# Altium schematic sheet PAGE14.SchDoc
size 386 x 246 mm
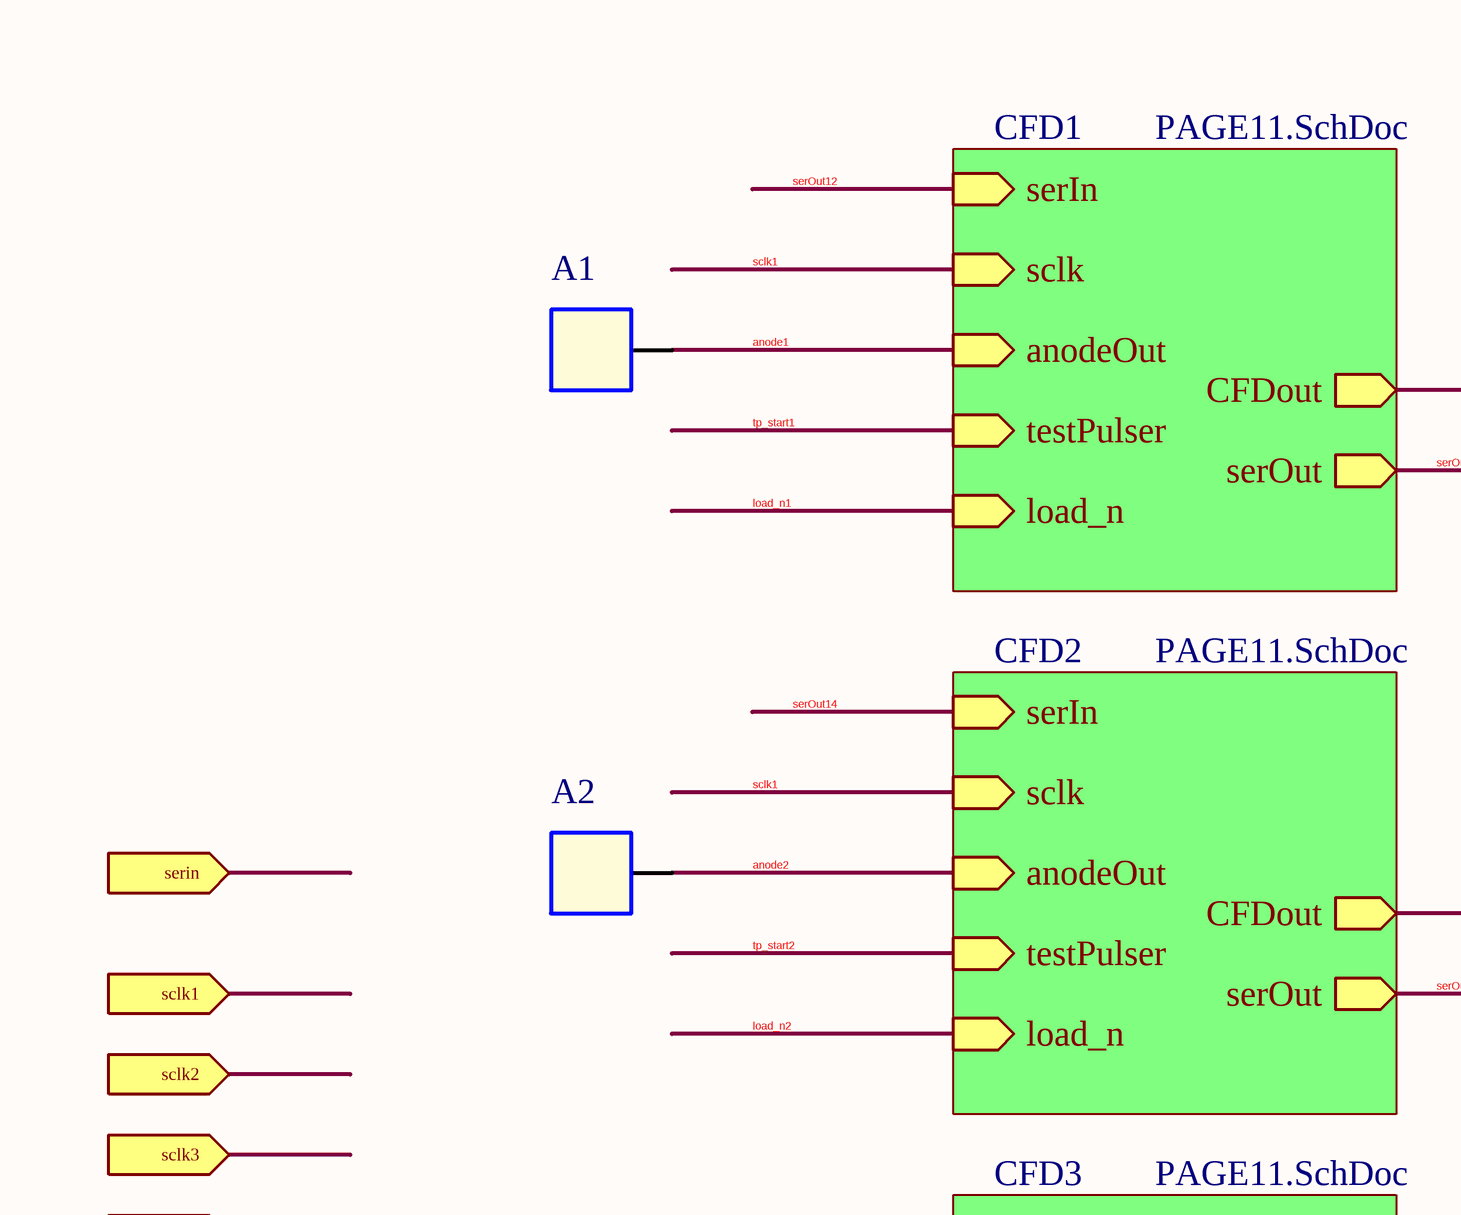
[diagram p0: PAGE14.SchDoc, top column 1 of 4]
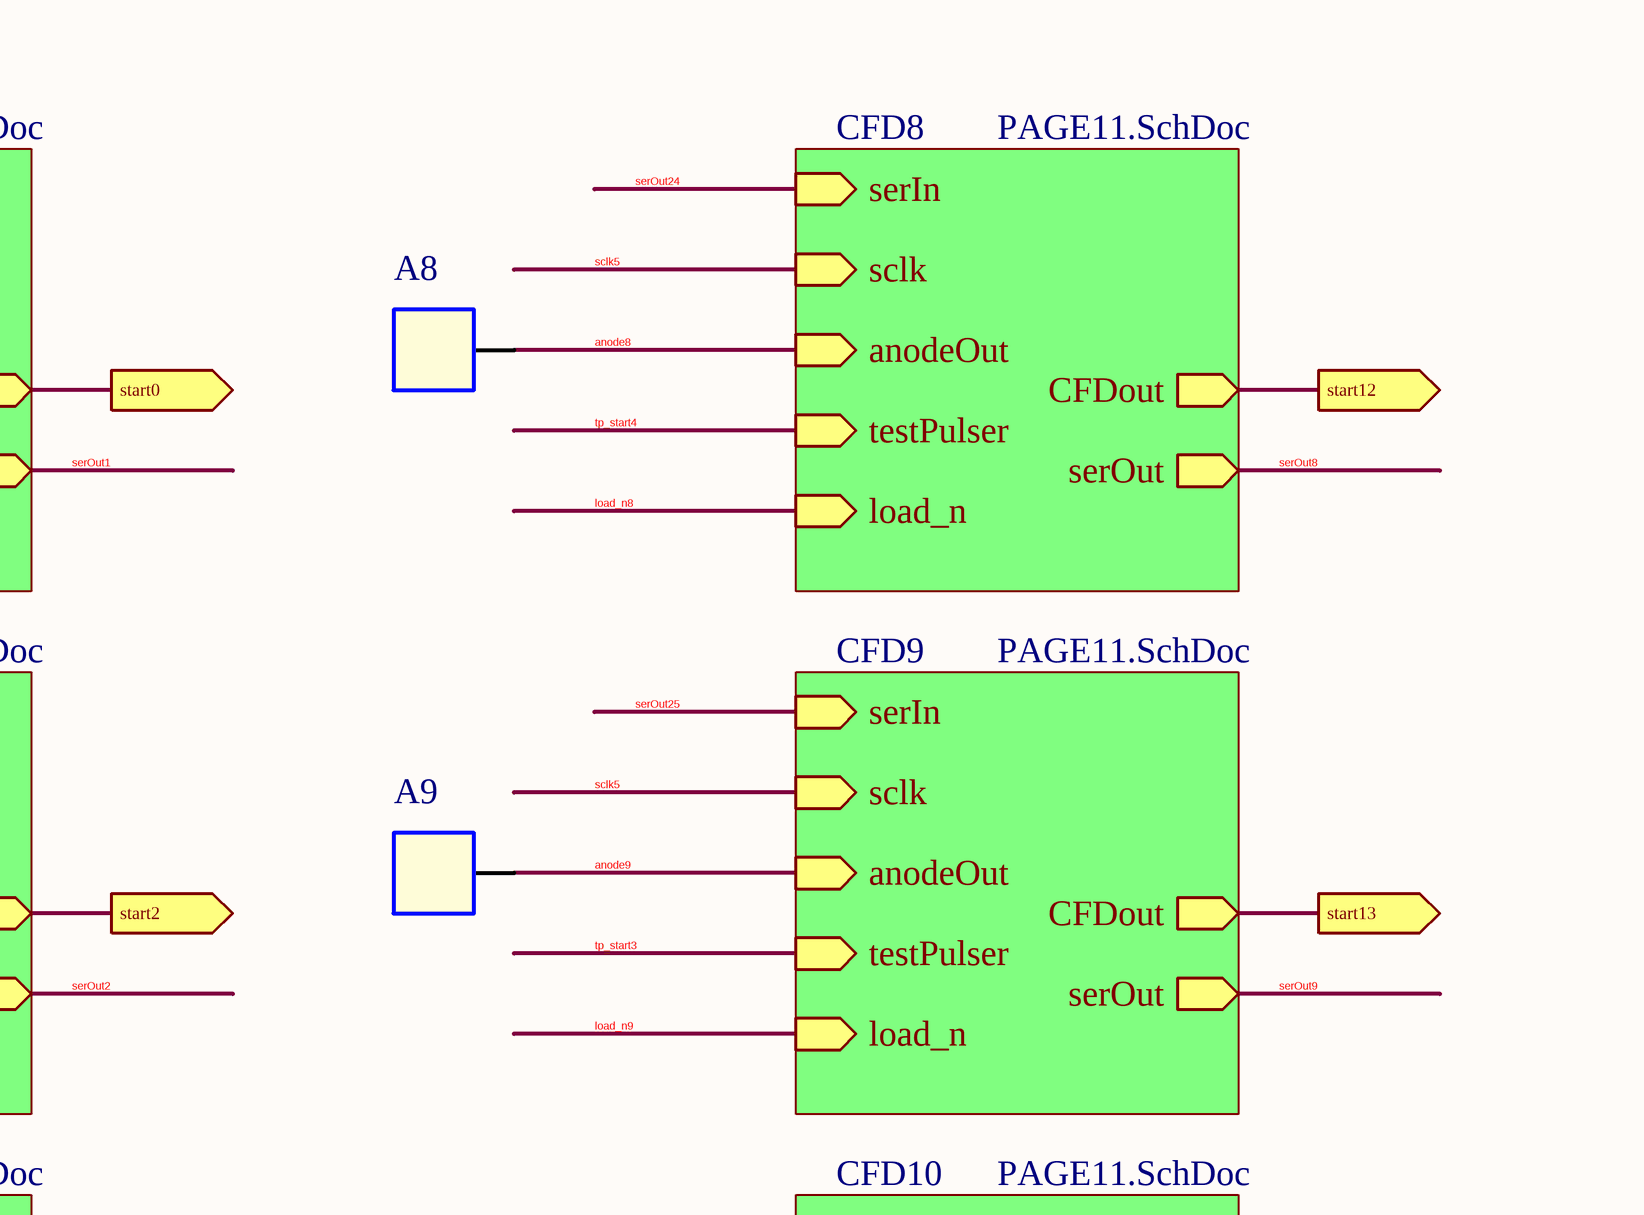
[diagram p1: PAGE14.SchDoc, top column 2 of 4]
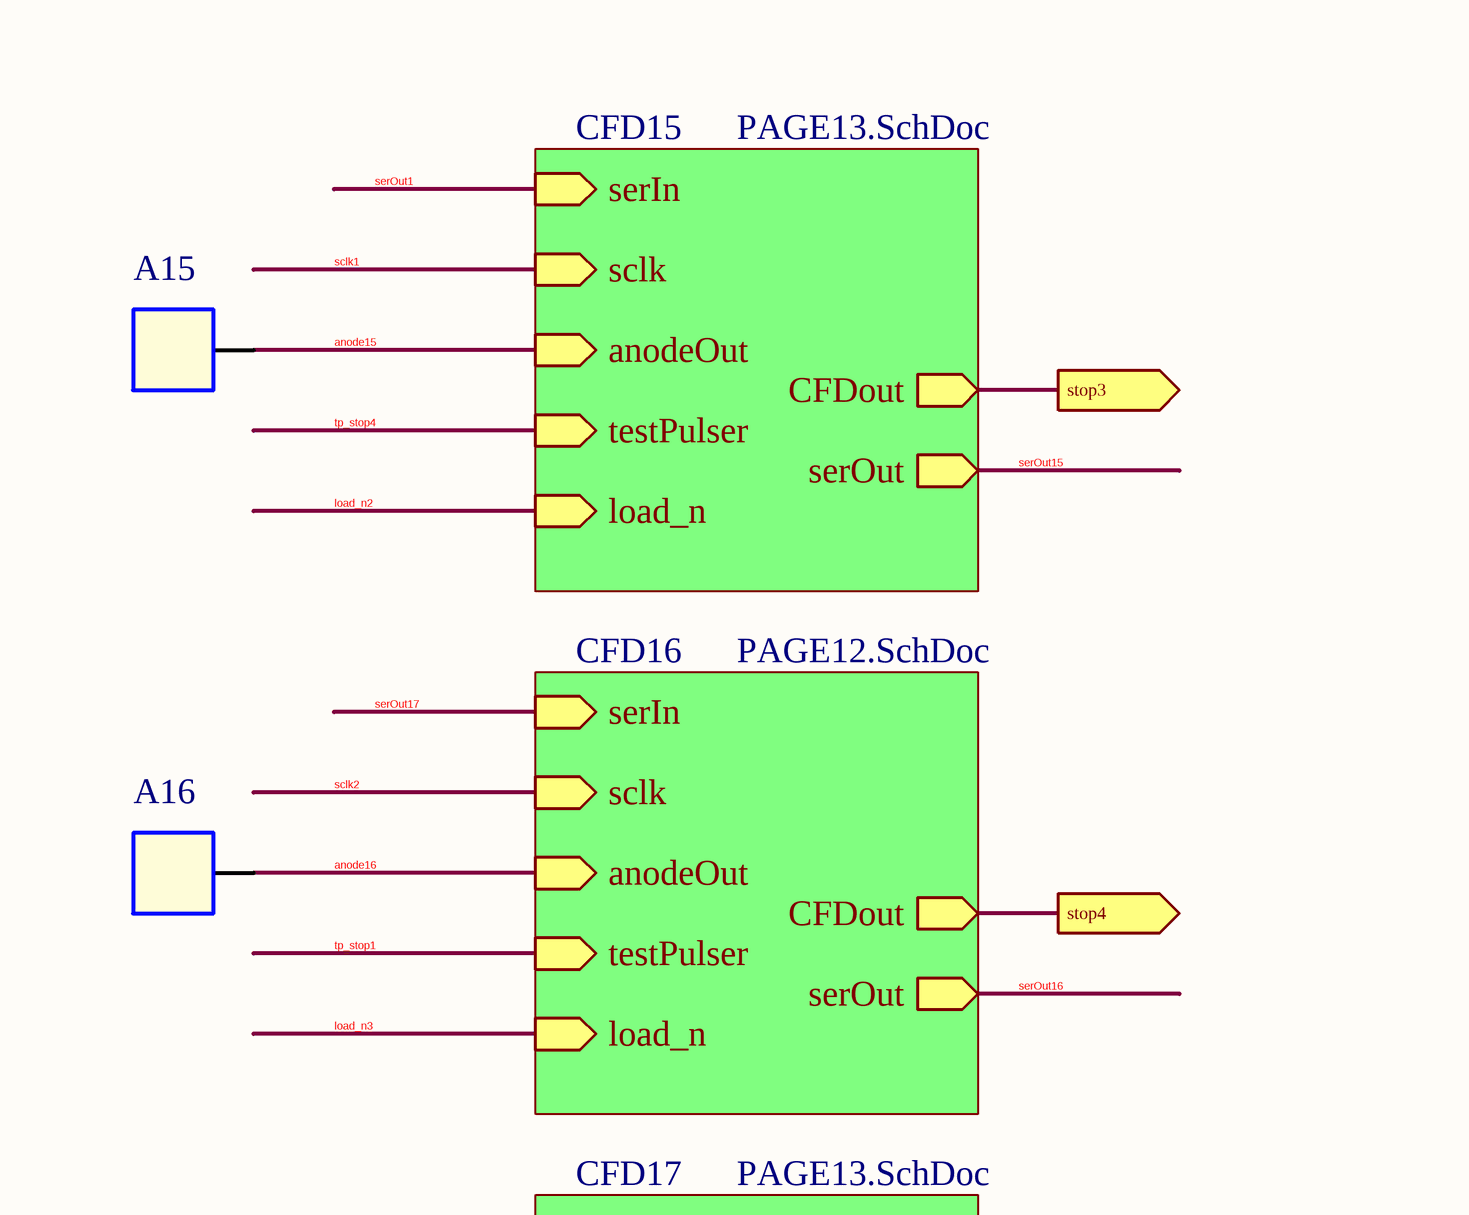
[diagram p2: PAGE14.SchDoc, top column 3 of 4]
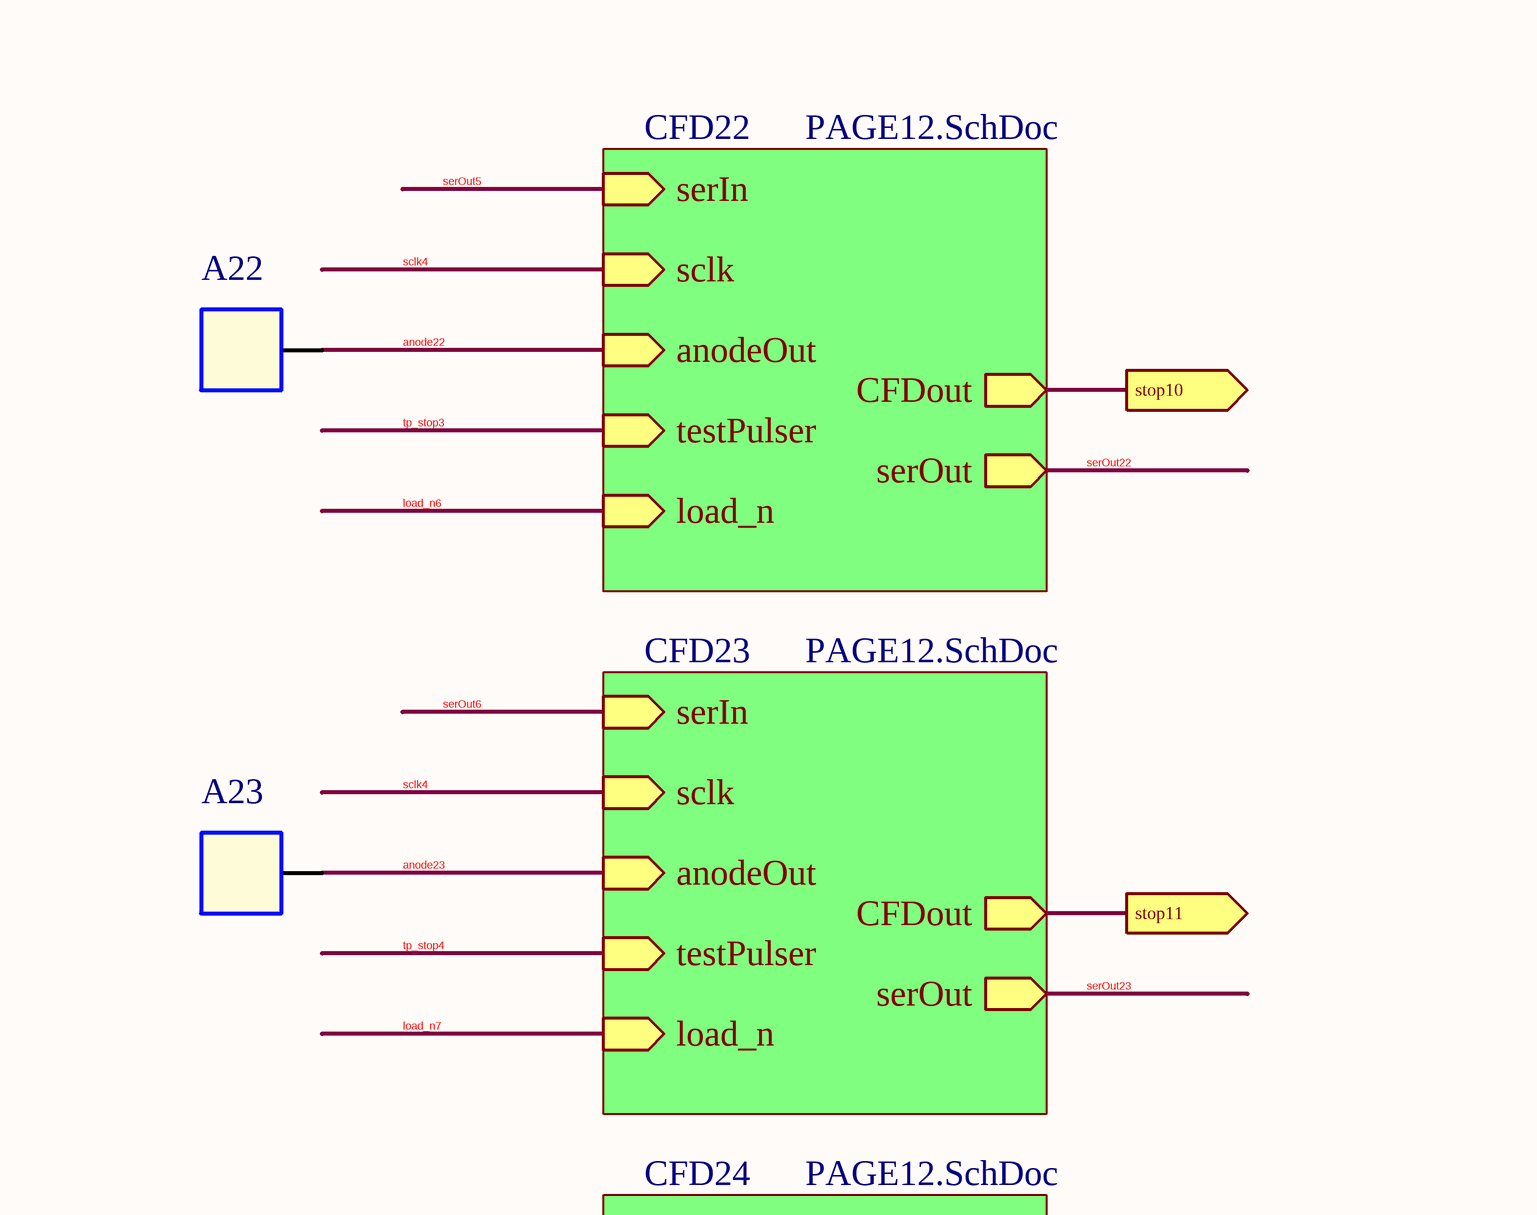
[diagram p3: PAGE14.SchDoc, top column 4 of 4]
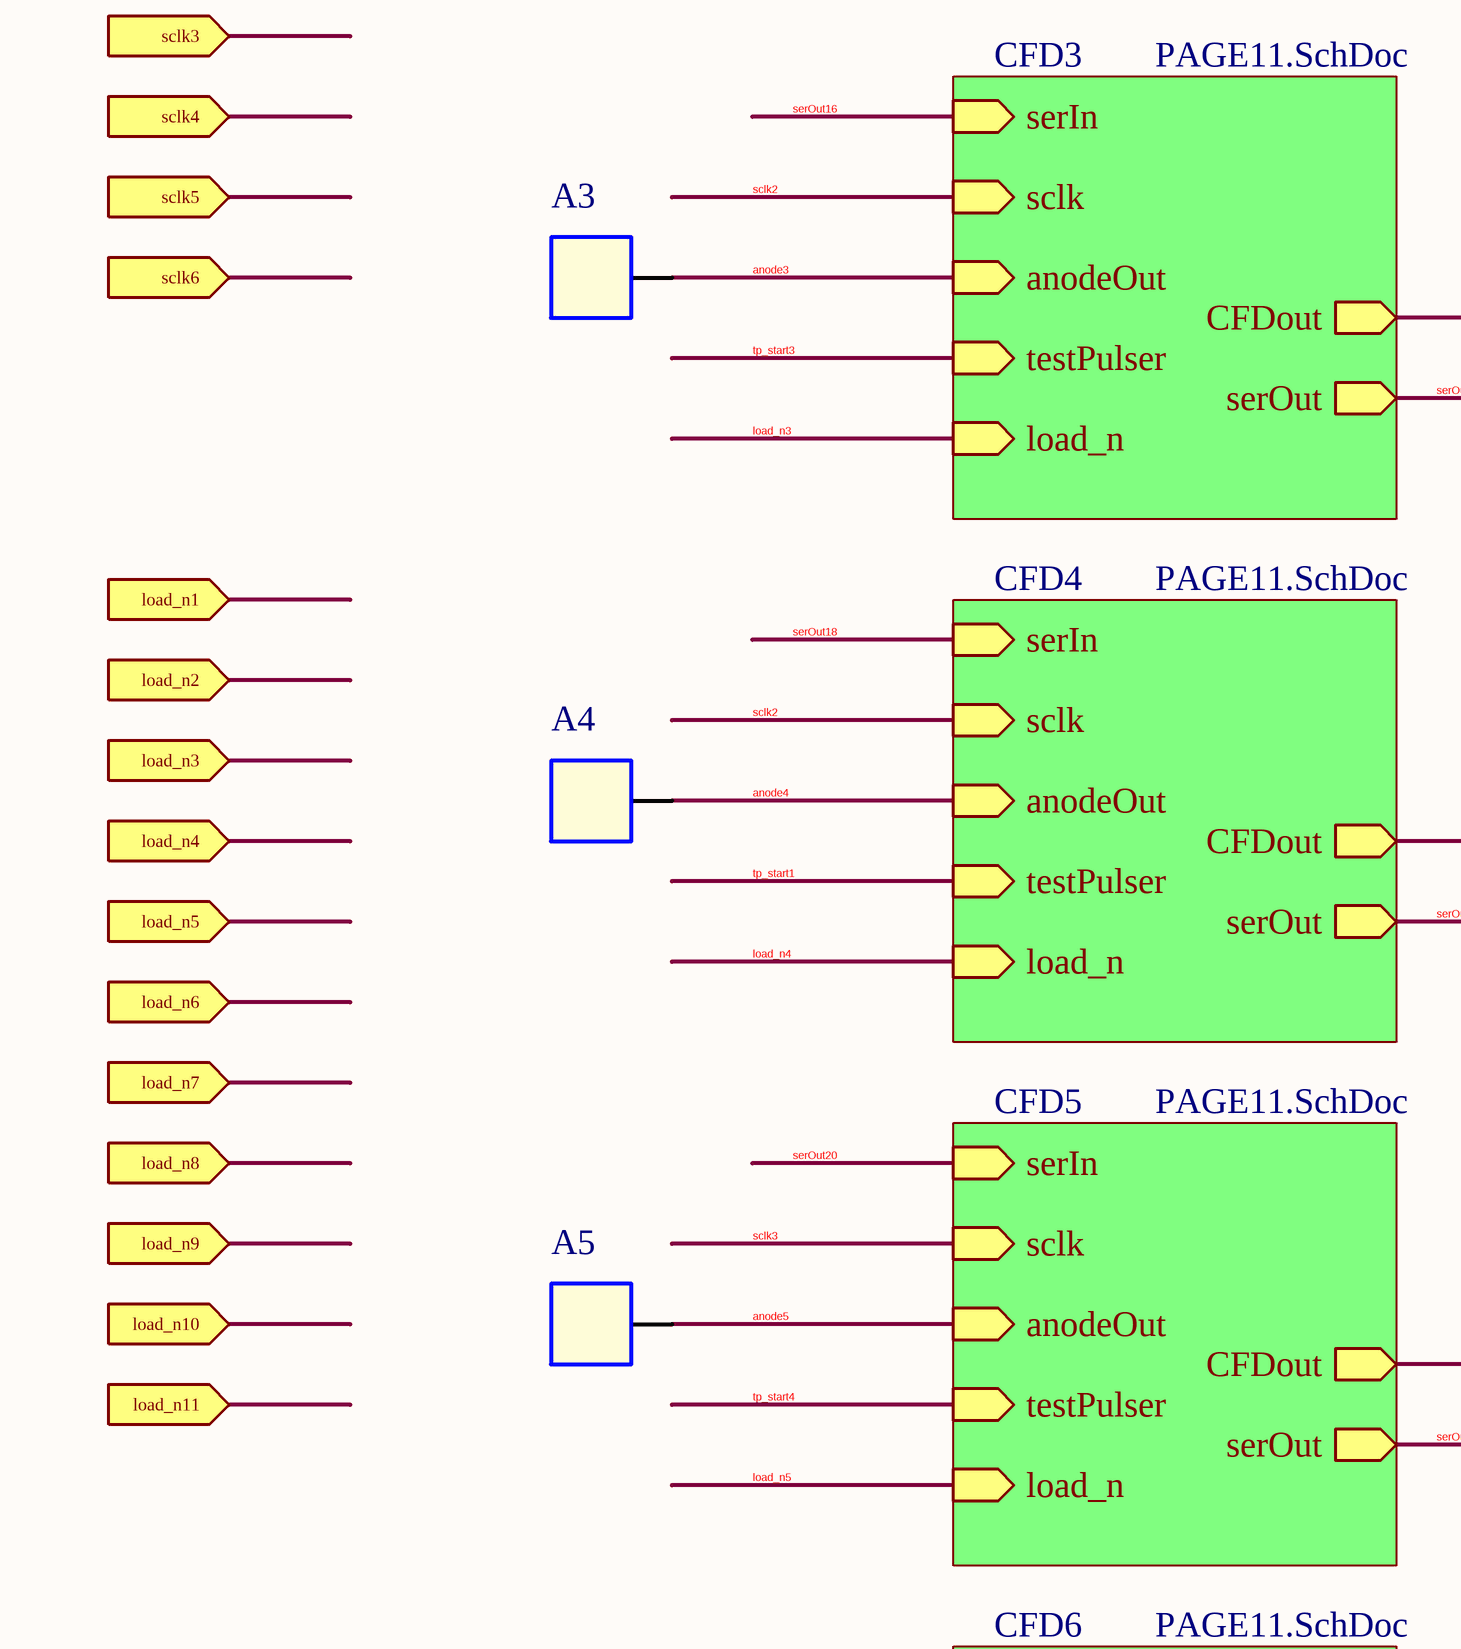
[diagram p4: PAGE14.SchDoc, centre column 1 of 4]
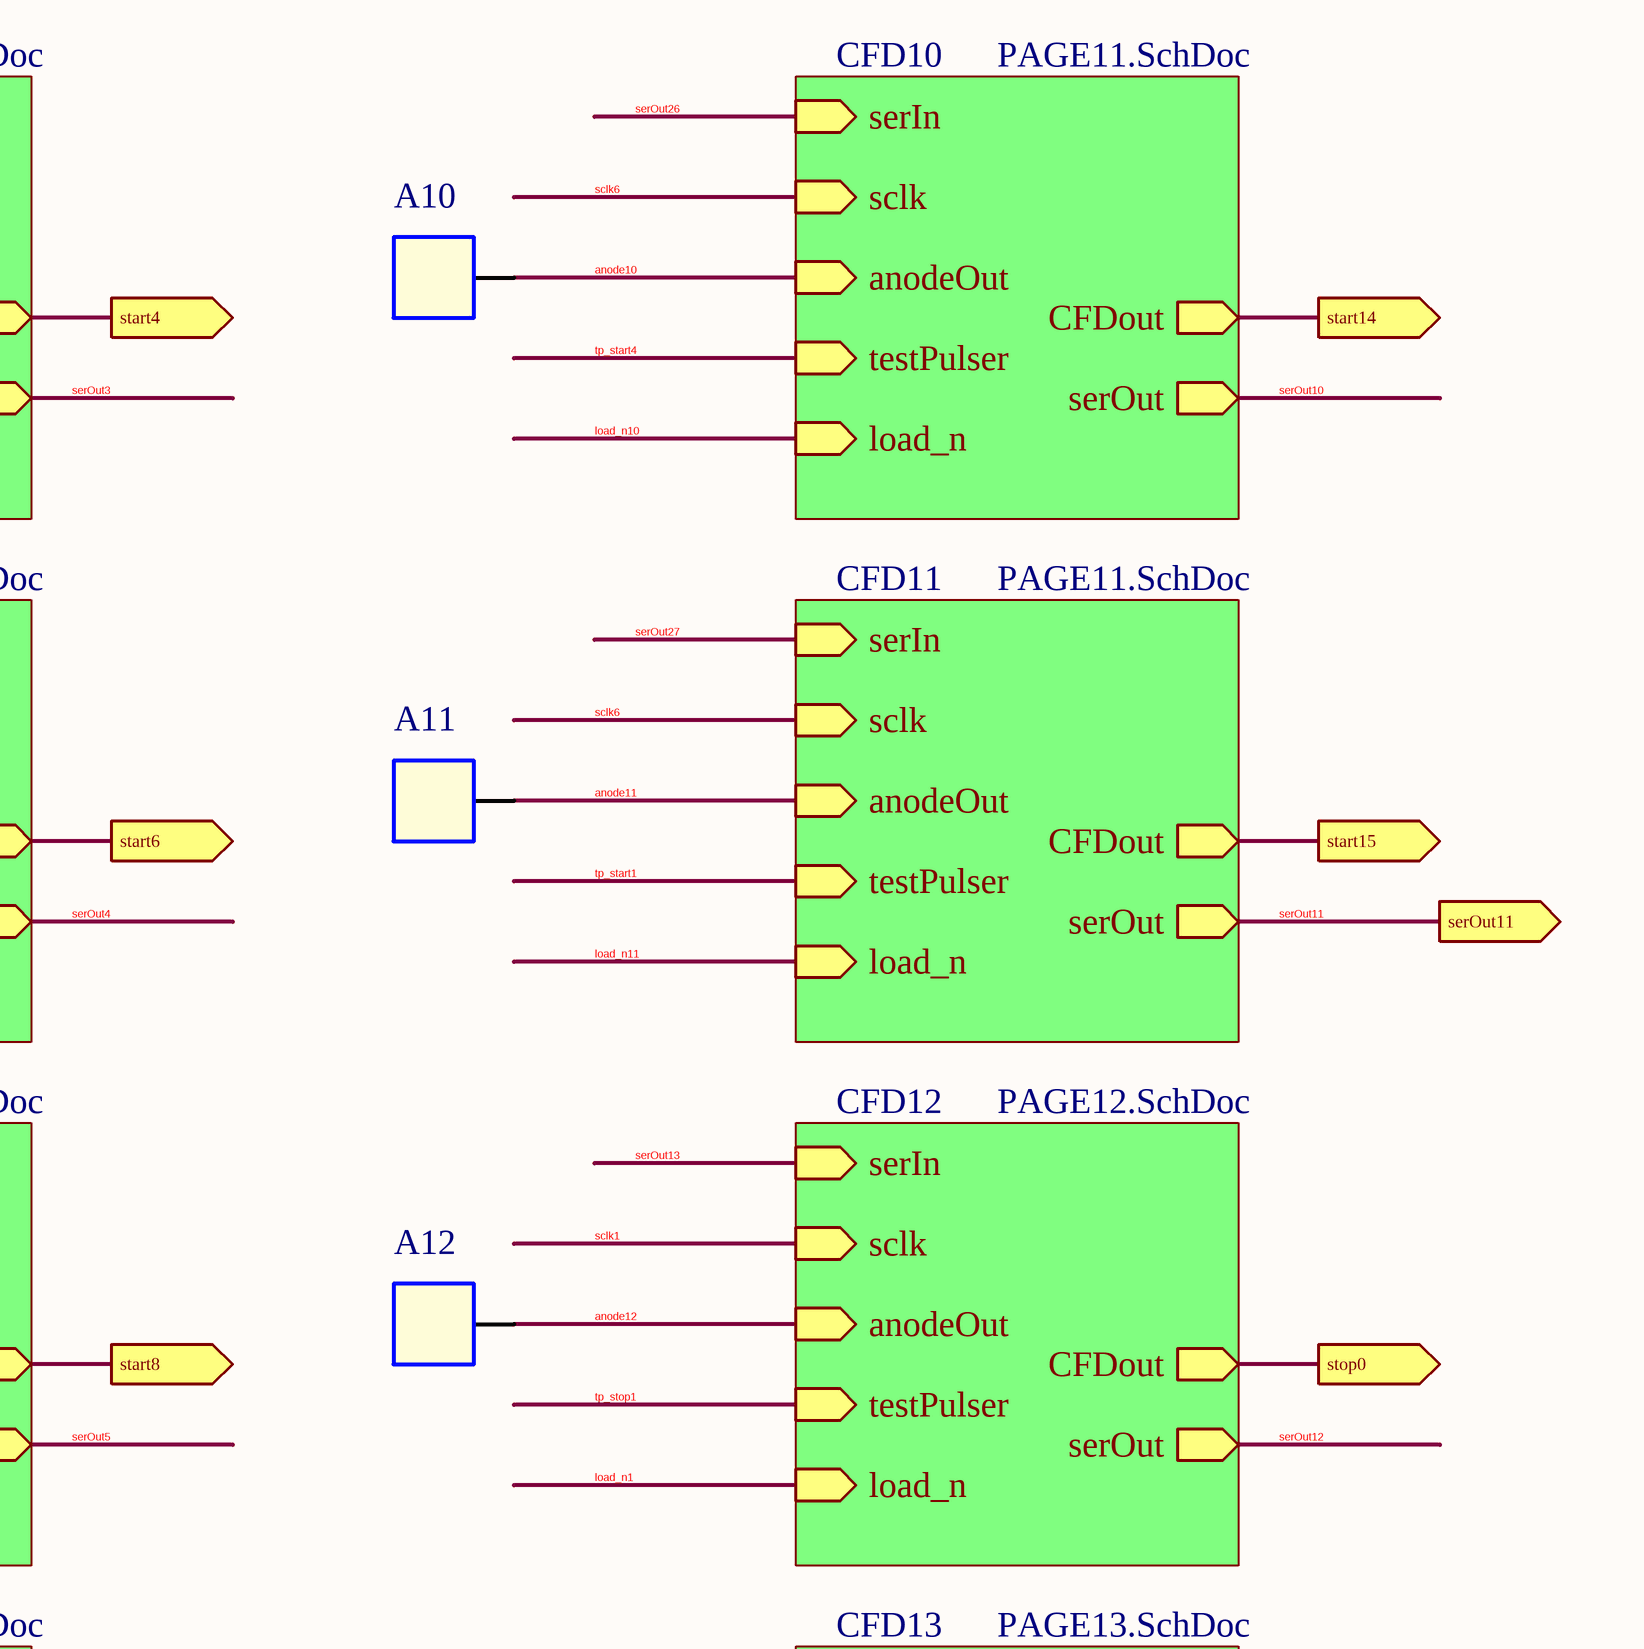
[diagram p5: PAGE14.SchDoc, centre column 2 of 4]
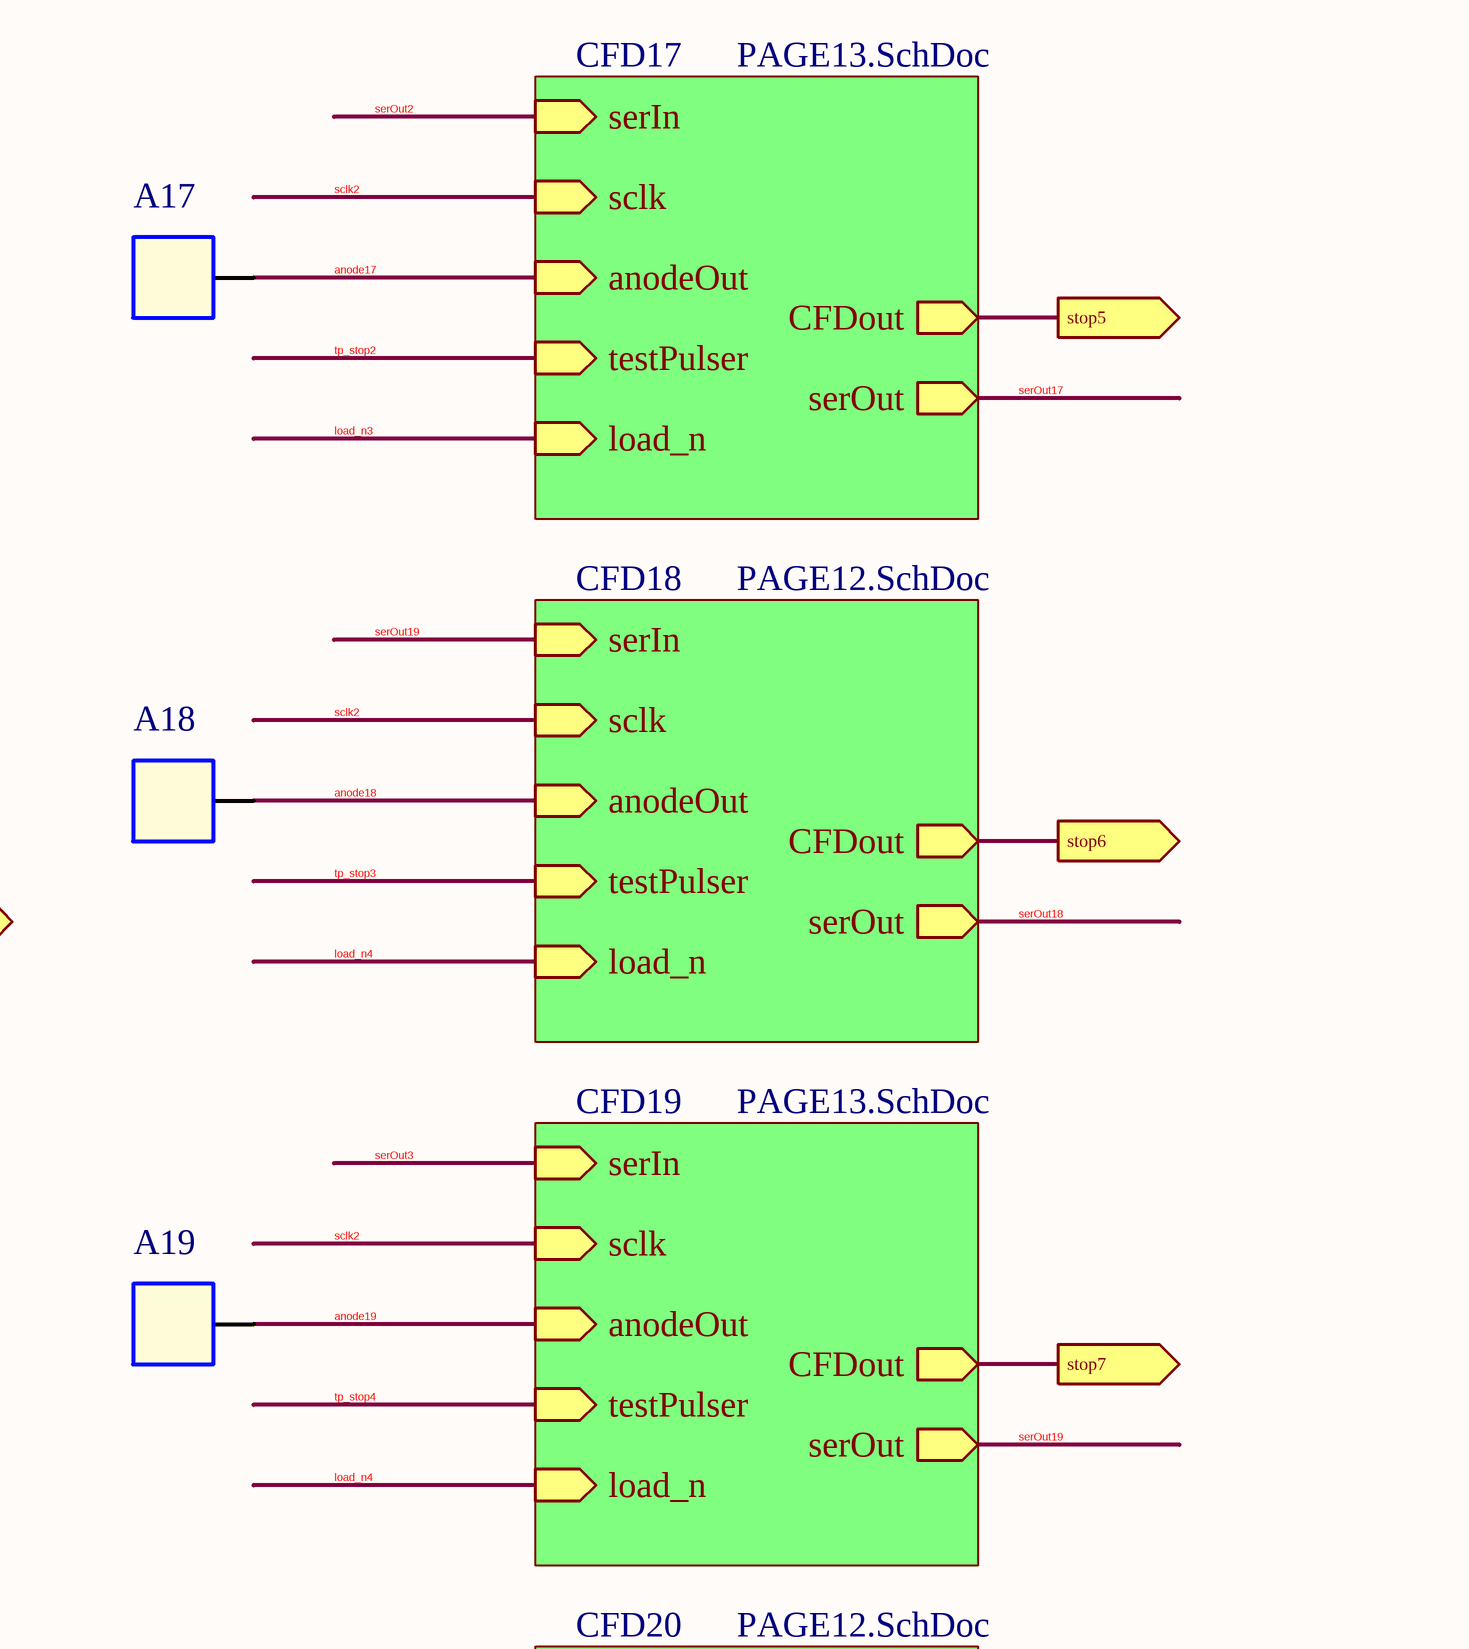
[diagram p6: PAGE14.SchDoc, centre column 3 of 4]
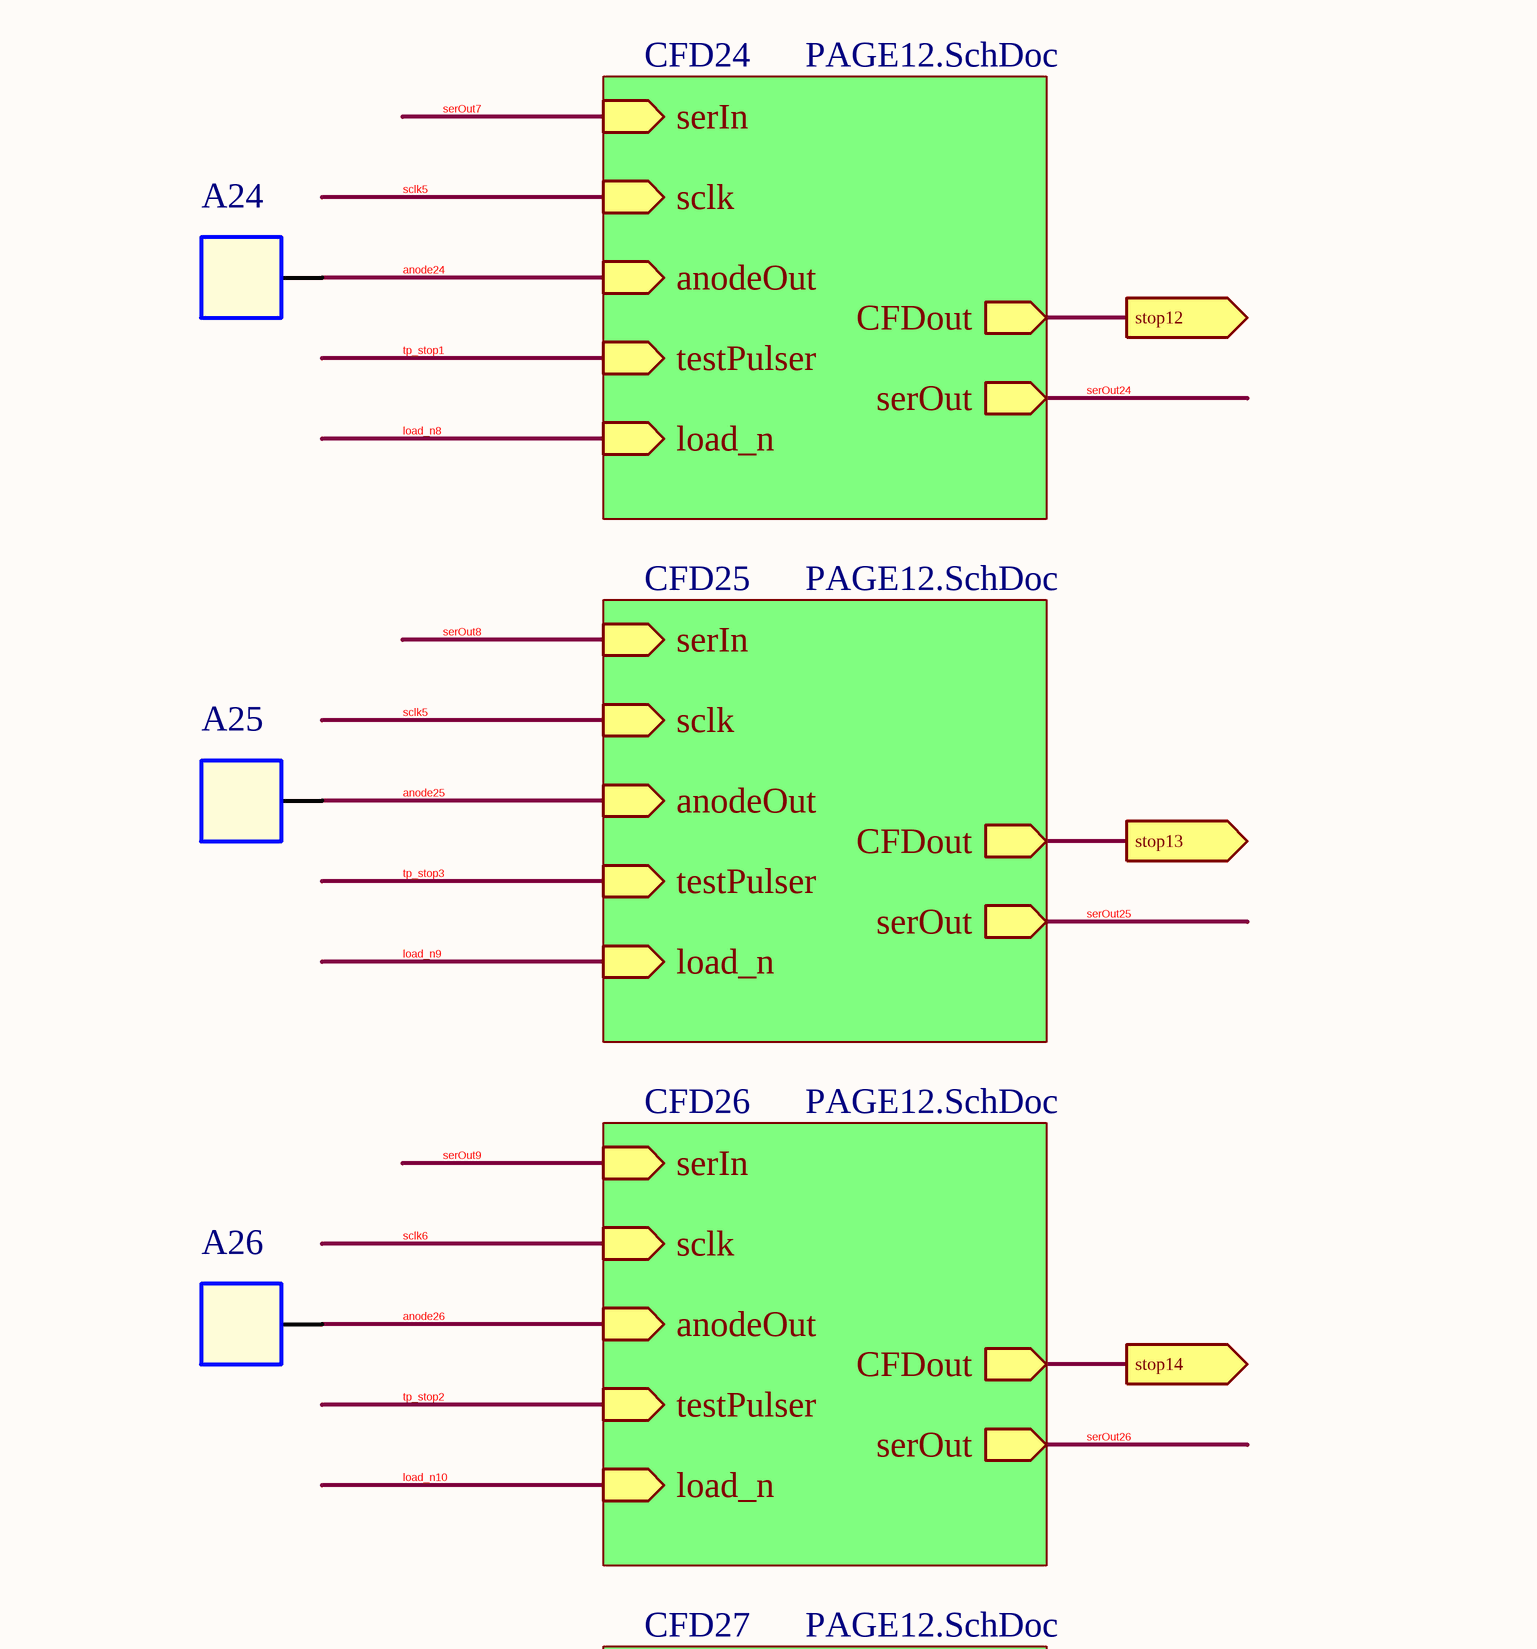
[diagram p7: PAGE14.SchDoc, centre column 4 of 4]
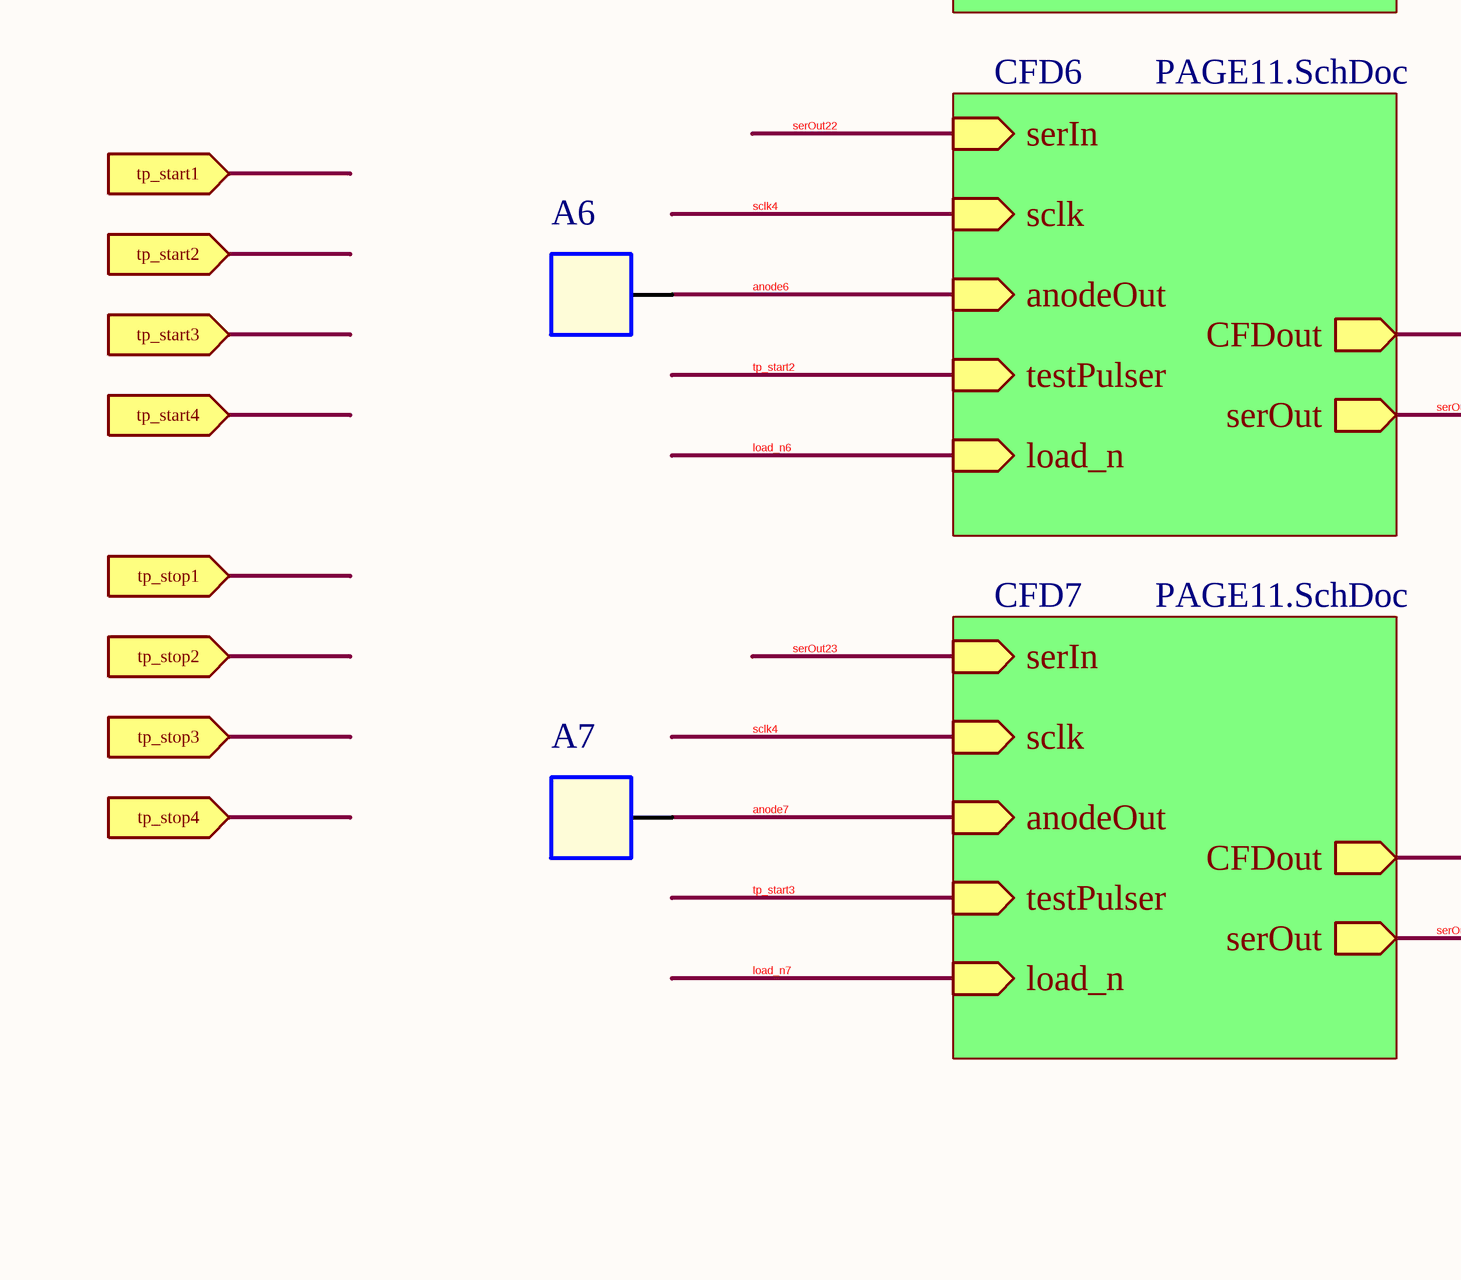
[diagram p8: PAGE14.SchDoc, bottom column 1 of 4]
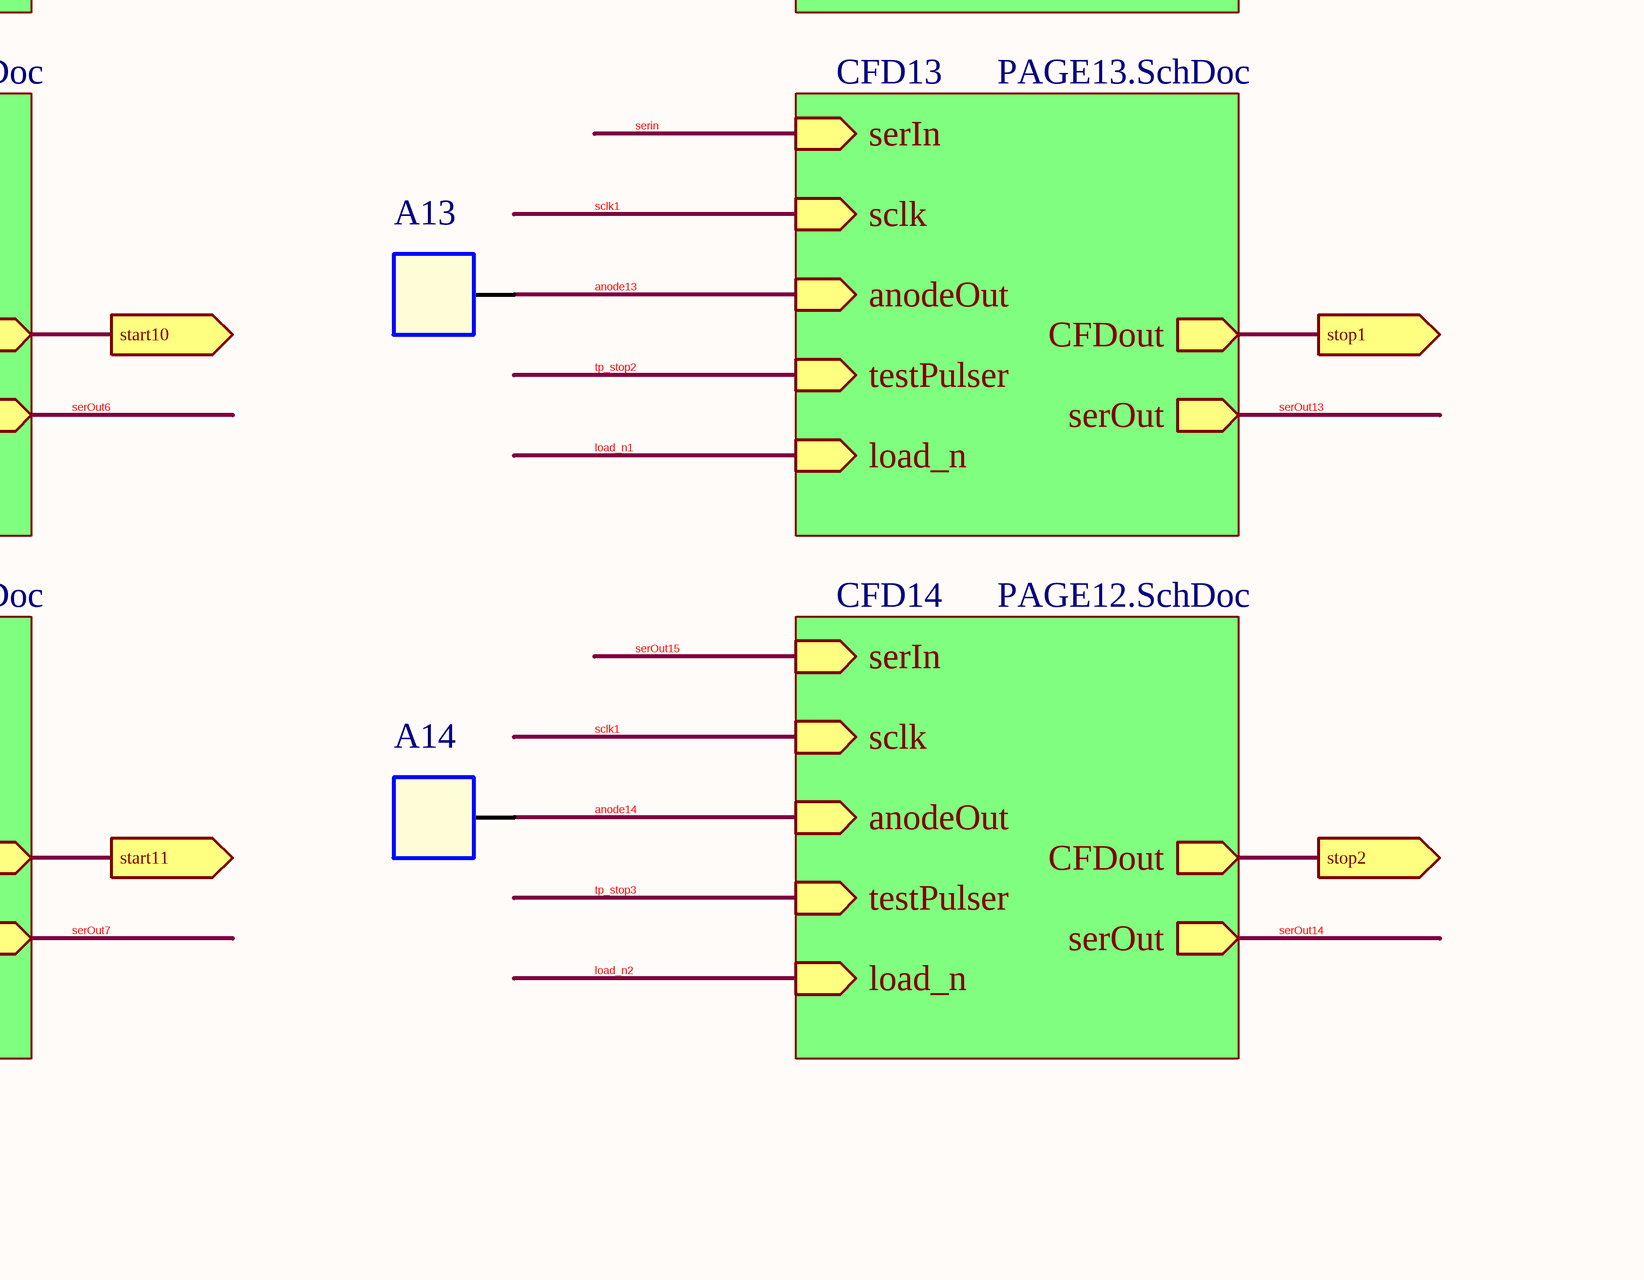
[diagram p9: PAGE14.SchDoc, bottom column 2 of 4]
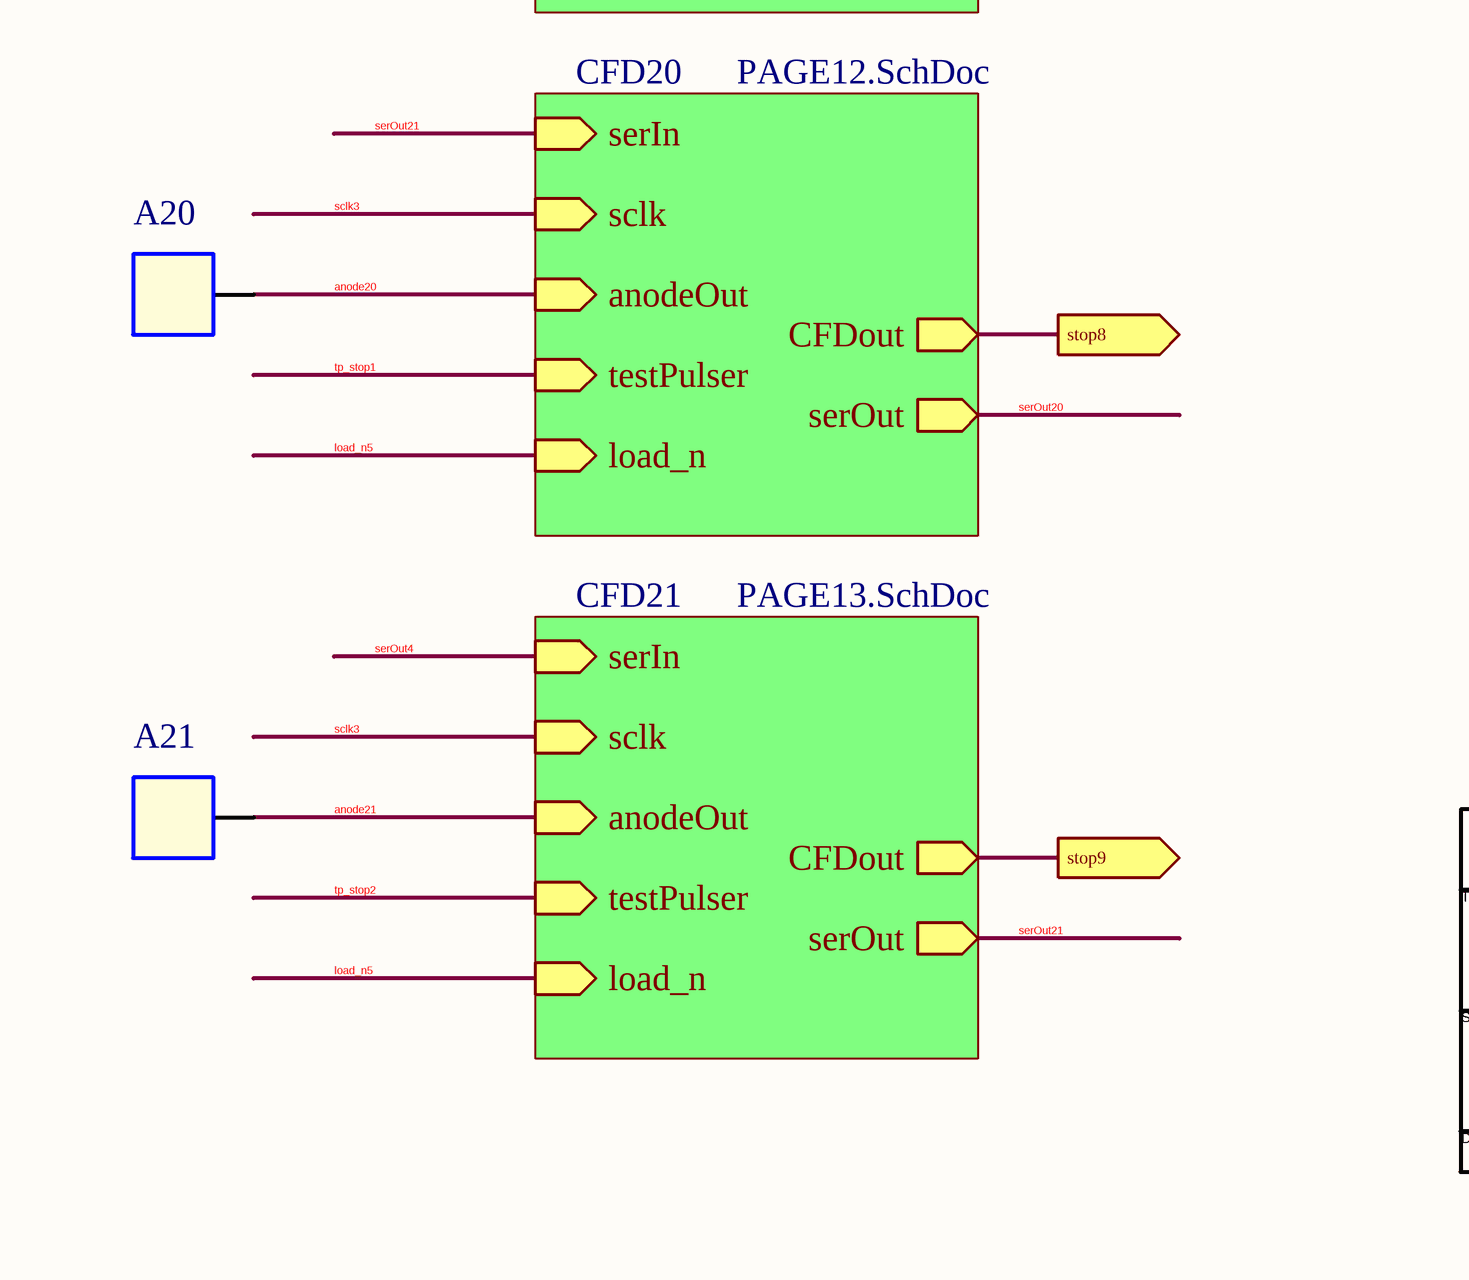
[diagram p10: PAGE14.SchDoc, bottom column 3 of 4]
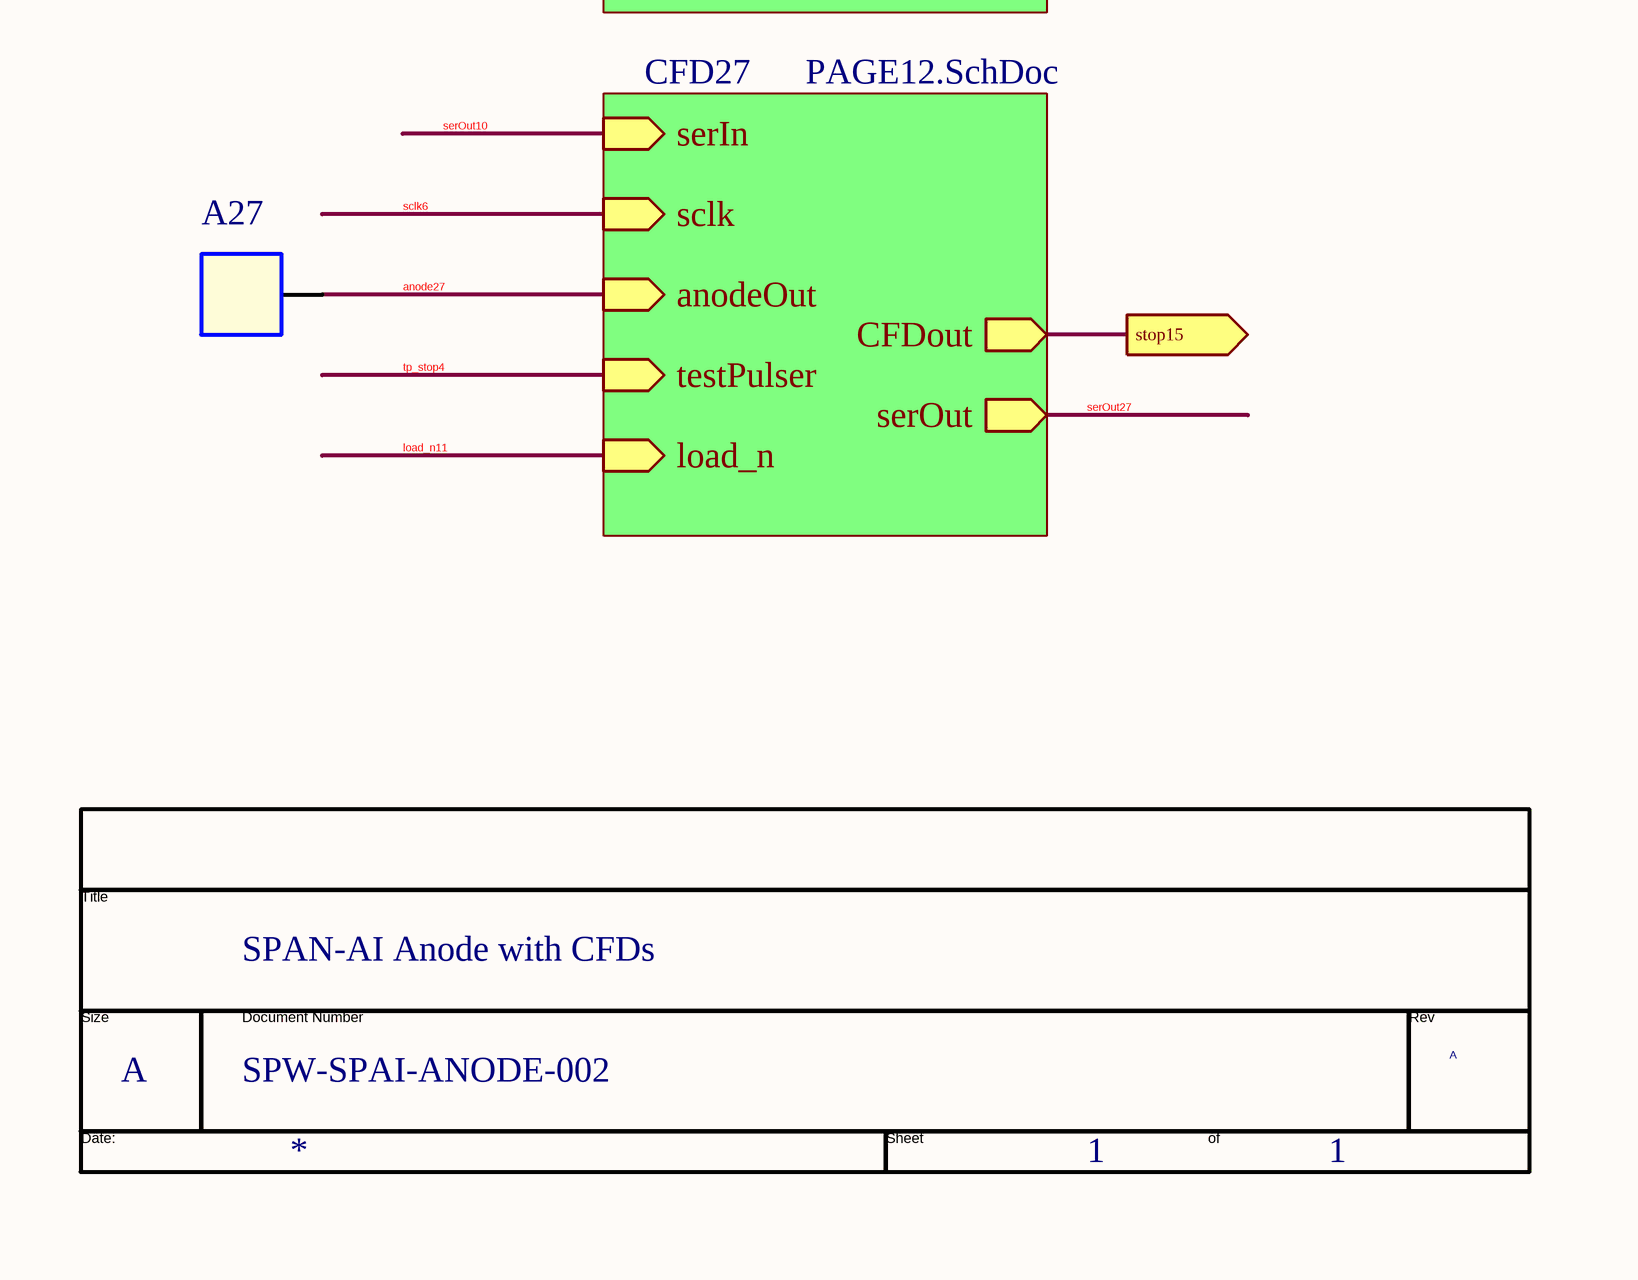
[diagram p11: PAGE14.SchDoc, bottom column 4 of 4]

## Parts
*  Page Count: 1  Page Size: A  Title: SPAN-AI Anode with CFDs  Doc: SPW-SPAI-ANODE-002  (hidden comment: TitleBlock0)  (graphical)
A1  anode  [anode]  (value not drawn)
A2  anode  [anode]  (value not drawn)
A3  anode  [anode]  (value not drawn)
A4  anode  [anode]  (value not drawn)
A5  anode  [anode]  (value not drawn)
A6  anode  [anode]  (value not drawn)
A7  anode  [anode]  (value not drawn)
A8  anode  [anode]  (value not drawn)
A9  anode  [anode]  (value not drawn)
A10  anode  [anode]  (value not drawn)
A11  anode  [anode]  (value not drawn)
A12  anode  [anode]  (value not drawn)
A13  anode  [anode]  (value not drawn)
A14  anode  [anode]  (value not drawn)
A15  anode  [anode]  (value not drawn)
A16  anode  [anode]  (value not drawn)
A17  anode  [anode]  (value not drawn)
A18  anode  [anode]  (value not drawn)
A19  anode  [anode]  (value not drawn)
A20  anode  [anode]  (value not drawn)
A21  anode  [anode]  (value not drawn)
A22  anode  [anode]  (value not drawn)
A23  anode  [anode]  (value not drawn)
A24  anode  [anode]  (value not drawn)
A25  anode  [anode]  (value not drawn)
A26  anode  [anode]  (value not drawn)
A27  anode  [anode]  (value not drawn)

## Sub-sheets
CFD1 = PAGE11.SchDoc: anodeOut (in), sclk (in), serIn (in), load_n (in), serOut (out), testPulser (in), CFDout (out)  | D101_PartReference: =CFD1_D101_PartReference; R107_PartReference: =CFD1_R107_PartReference; R105_PartReference: =CFD1_R105_PartReference; R104_PartReference: =CFD1_R104_PartReference; DL101_PartReference: =CFD1_DL101_PartReference; C104_PartReference: =CFD1_C104_PartReference; R108_PartReference: =CFD1_R108_PartReference; C102_PartReference: =CFD1_C102_PartReference; R109_PartReference: =CFD1_R109_PartReference; R102_PartReference: =CFD1_R102_PartReference; R101_PartReference: =CFD1_R101_PartReference; R103_PartReference: =CFD1_R103_PartReference; C105_PartReference: =CFD1_C105_PartReference; U101_PartReference: =CFD1_U101_PartReference; C101_PartReference: =CFD1_C101_PartReference; C107_PartReference: =CFD1_C107_PartReference; R106_PartReference: =CFD1_R106_PartReference; C106_PartReference: =CFD1_C106_PartReference; C100_PartReference: =CFD1_C100_PartReference; C103_PartReference: =CFD1_C103_PartReference; TitleBlock_2_Page_Number: =CFD1_TitleBlock_2_Page_Number
CFD2 = PAGE11.SchDoc: anodeOut (in), sclk (in), serIn (in), load_n (in), serOut (out), testPulser (in), CFDout (out)  | D101_PartReference: =CFD2_D101_PartReference; R107_PartReference: =CFD2_R107_PartReference; R105_PartReference: =CFD2_R105_PartReference; R104_PartReference: =CFD2_R104_PartReference; DL101_PartReference: =CFD2_DL101_PartReference; C104_PartReference: =CFD2_C104_PartReference; R108_PartReference: =CFD2_R108_PartReference; C102_PartReference: =CFD2_C102_PartReference; R109_PartReference: =CFD2_R109_PartReference; R102_PartReference: =CFD2_R102_PartReference; R101_PartReference: =CFD2_R101_PartReference; R103_PartReference: =CFD2_R103_PartReference; C105_PartReference: =CFD2_C105_PartReference; U101_PartReference: =CFD2_U101_PartReference; C101_PartReference: =CFD2_C101_PartReference; C107_PartReference: =CFD2_C107_PartReference; R106_PartReference: =CFD2_R106_PartReference; C106_PartReference: =CFD2_C106_PartReference; C100_PartReference: =CFD2_C100_PartReference; C103_PartReference: =CFD2_C103_PartReference; TitleBlock_2_Page_Number: =CFD2_TitleBlock_2_Page_Number
CFD3 = PAGE11.SchDoc: anodeOut (in), sclk (in), serIn (in), load_n (in), serOut (out), testPulser (in), CFDout (out)  | D101_PartReference: =CFD3_D101_PartReference; R107_PartReference: =CFD3_R107_PartReference; R105_PartReference: =CFD3_R105_PartReference; R104_PartReference: =CFD3_R104_PartReference; DL101_PartReference: =CFD3_DL101_PartReference; C104_PartReference: =CFD3_C104_PartReference; R108_PartReference: =CFD3_R108_PartReference; C102_PartReference: =CFD3_C102_PartReference; R109_PartReference: =CFD3_R109_PartReference; R102_PartReference: =CFD3_R102_PartReference; R101_PartReference: =CFD3_R101_PartReference; R103_PartReference: =CFD3_R103_PartReference; C105_PartReference: =CFD3_C105_PartReference; U101_PartReference: =CFD3_U101_PartReference; C101_PartReference: =CFD3_C101_PartReference; C107_PartReference: =CFD3_C107_PartReference; R106_PartReference: =CFD3_R106_PartReference; C106_PartReference: =CFD3_C106_PartReference; C100_PartReference: =CFD3_C100_PartReference; C103_PartReference: =CFD3_C103_PartReference; TitleBlock_2_Page_Number: =CFD3_TitleBlock_2_Page_Number
CFD4 = PAGE11.SchDoc: anodeOut (in), sclk (in), serIn (in), load_n (in), serOut (out), testPulser (in), CFDout (out)  | D101_PartReference: =CFD4_D101_PartReference; R107_PartReference: =CFD4_R107_PartReference; R105_PartReference: =CFD4_R105_PartReference; R104_PartReference: =CFD4_R104_PartReference; DL101_PartReference: =CFD4_DL101_PartReference; C104_PartReference: =CFD4_C104_PartReference; R108_PartReference: =CFD4_R108_PartReference; C102_PartReference: =CFD4_C102_PartReference; R109_PartReference: =CFD4_R109_PartReference; R102_PartReference: =CFD4_R102_PartReference; R101_PartReference: =CFD4_R101_PartReference; R103_PartReference: =CFD4_R103_PartReference; C105_PartReference: =CFD4_C105_PartReference; U101_PartReference: =CFD4_U101_PartReference; C101_PartReference: =CFD4_C101_PartReference; C107_PartReference: =CFD4_C107_PartReference; R106_PartReference: =CFD4_R106_PartReference; C106_PartReference: =CFD4_C106_PartReference; C100_PartReference: =CFD4_C100_PartReference; C103_PartReference: =CFD4_C103_PartReference; TitleBlock_2_Page_Number: =CFD4_TitleBlock_2_Page_Number
CFD5 = PAGE11.SchDoc: anodeOut (in), sclk (in), serIn (in), load_n (in), serOut (out), testPulser (in), CFDout (out)  | D101_PartReference: =CFD5_D101_PartReference; R107_PartReference: =CFD5_R107_PartReference; R105_PartReference: =CFD5_R105_PartReference; R104_PartReference: =CFD5_R104_PartReference; DL101_PartReference: =CFD5_DL101_PartReference; C104_PartReference: =CFD5_C104_PartReference; R108_PartReference: =CFD5_R108_PartReference; C102_PartReference: =CFD5_C102_PartReference; R109_PartReference: =CFD5_R109_PartReference; R102_PartReference: =CFD5_R102_PartReference; R101_PartReference: =CFD5_R101_PartReference; R103_PartReference: =CFD5_R103_PartReference; C105_PartReference: =CFD5_C105_PartReference; U101_PartReference: =CFD5_U101_PartReference; C101_PartReference: =CFD5_C101_PartReference; C107_PartReference: =CFD5_C107_PartReference; R106_PartReference: =CFD5_R106_PartReference; C106_PartReference: =CFD5_C106_PartReference; C100_PartReference: =CFD5_C100_PartReference; C103_PartReference: =CFD5_C103_PartReference; TitleBlock_2_Page_Number: =CFD5_TitleBlock_2_Page_Number
CFD6 = PAGE11.SchDoc: anodeOut (in), sclk (in), serIn (in), load_n (in), serOut (out), testPulser (in), CFDout (out)  | D101_PartReference: =CFD6_D101_PartReference; R107_PartReference: =CFD6_R107_PartReference; R105_PartReference: =CFD6_R105_PartReference; R104_PartReference: =CFD6_R104_PartReference; DL101_PartReference: =CFD6_DL101_PartReference; C104_PartReference: =CFD6_C104_PartReference; R108_PartReference: =CFD6_R108_PartReference; C102_PartReference: =CFD6_C102_PartReference; R109_PartReference: =CFD6_R109_PartReference; R102_PartReference: =CFD6_R102_PartReference; R101_PartReference: =CFD6_R101_PartReference; R103_PartReference: =CFD6_R103_PartReference; C105_PartReference: =CFD6_C105_PartReference; U101_PartReference: =CFD6_U101_PartReference; C101_PartReference: =CFD6_C101_PartReference; C107_PartReference: =CFD6_C107_PartReference; R106_PartReference: =CFD6_R106_PartReference; C106_PartReference: =CFD6_C106_PartReference; C100_PartReference: =CFD6_C100_PartReference; C103_PartReference: =CFD6_C103_PartReference; TitleBlock_2_Page_Number: =CFD6_TitleBlock_2_Page_Number
CFD7 = PAGE11.SchDoc: anodeOut (in), sclk (in), serIn (in), load_n (in), serOut (out), testPulser (in), CFDout (out)  | D101_PartReference: =CFD7_D101_PartReference; R107_PartReference: =CFD7_R107_PartReference; R105_PartReference: =CFD7_R105_PartReference; R104_PartReference: =CFD7_R104_PartReference; DL101_PartReference: =CFD7_DL101_PartReference; C104_PartReference: =CFD7_C104_PartReference; R108_PartReference: =CFD7_R108_PartReference; C102_PartReference: =CFD7_C102_PartReference; R109_PartReference: =CFD7_R109_PartReference; R102_PartReference: =CFD7_R102_PartReference; R101_PartReference: =CFD7_R101_PartReference; R103_PartReference: =CFD7_R103_PartReference; C105_PartReference: =CFD7_C105_PartReference; U101_PartReference: =CFD7_U101_PartReference; C101_PartReference: =CFD7_C101_PartReference; C107_PartReference: =CFD7_C107_PartReference; R106_PartReference: =CFD7_R106_PartReference; C106_PartReference: =CFD7_C106_PartReference; C100_PartReference: =CFD7_C100_PartReference; C103_PartReference: =CFD7_C103_PartReference; TitleBlock_2_Page_Number: =CFD7_TitleBlock_2_Page_Number
CFD8 = PAGE11.SchDoc: anodeOut (in), sclk (in), serIn (in), load_n (in), serOut (out), testPulser (in), CFDout (out)  | D101_PartReference: =CFD8_D101_PartReference; R107_PartReference: =CFD8_R107_PartReference; R105_PartReference: =CFD8_R105_PartReference; R104_PartReference: =CFD8_R104_PartReference; DL101_PartReference: =CFD8_DL101_PartReference; C104_PartReference: =CFD8_C104_PartReference; R108_PartReference: =CFD8_R108_PartReference; C102_PartReference: =CFD8_C102_PartReference; R109_PartReference: =CFD8_R109_PartReference; R102_PartReference: =CFD8_R102_PartReference; R101_PartReference: =CFD8_R101_PartReference; R103_PartReference: =CFD8_R103_PartReference; C105_PartReference: =CFD8_C105_PartReference; U101_PartReference: =CFD8_U101_PartReference; C101_PartReference: =CFD8_C101_PartReference; C107_PartReference: =CFD8_C107_PartReference; R106_PartReference: =CFD8_R106_PartReference; C106_PartReference: =CFD8_C106_PartReference; C100_PartReference: =CFD8_C100_PartReference; C103_PartReference: =CFD8_C103_PartReference; TitleBlock_2_Page_Number: =CFD8_TitleBlock_2_Page_Number
CFD9 = PAGE11.SchDoc: anodeOut (in), sclk (in), serIn (in), load_n (in), serOut (out), testPulser (in), CFDout (out)  | D101_PartReference: =CFD9_D101_PartReference; R107_PartReference: =CFD9_R107_PartReference; R105_PartReference: =CFD9_R105_PartReference; R104_PartReference: =CFD9_R104_PartReference; DL101_PartReference: =CFD9_DL101_PartReference; C104_PartReference: =CFD9_C104_PartReference; R108_PartReference: =CFD9_R108_PartReference; C102_PartReference: =CFD9_C102_PartReference; R109_PartReference: =CFD9_R109_PartReference; R102_PartReference: =CFD9_R102_PartReference; R101_PartReference: =CFD9_R101_PartReference; R103_PartReference: =CFD9_R103_PartReference; C105_PartReference: =CFD9_C105_PartReference; U101_PartReference: =CFD9_U101_PartReference; C101_PartReference: =CFD9_C101_PartReference; C107_PartReference: =CFD9_C107_PartReference; R106_PartReference: =CFD9_R106_PartReference; C106_PartReference: =CFD9_C106_PartReference; C100_PartReference: =CFD9_C100_PartReference; C103_PartReference: =CFD9_C103_PartReference; TitleBlock_2_Page_Number: =CFD9_TitleBlock_2_Page_Number
CFD10 = PAGE11.SchDoc: anodeOut (in), sclk (in), serIn (in), load_n (in), serOut (out), testPulser (in), CFDout (out)  | D101_PartReference: =CFD10_D101_PartReference; R107_PartReference: =CFD10_R107_PartReference; R105_PartReference: =CFD10_R105_PartReference; R104_PartReference: =CFD10_R104_PartReference; DL101_PartReference: =CFD10_DL101_PartReference; C104_PartReference: =CFD10_C104_PartReference; R108_PartReference: =CFD10_R108_PartReference; C102_PartReference: =CFD10_C102_PartReference; R109_PartReference: =CFD10_R109_PartReference; R102_PartReference: =CFD10_R102_PartReference; R101_PartReference: =CFD10_R101_PartReference; R103_PartReference: =CFD10_R103_PartReference; C105_PartReference: =CFD10_C105_PartReference; U101_PartReference: =CFD10_U101_PartReference; C101_PartReference: =CFD10_C101_PartReference; C107_PartReference: =CFD10_C107_PartReference; R106_PartReference: =CFD10_R106_PartReference; C106_PartReference: =CFD10_C106_PartReference; C100_PartReference: =CFD10_C100_PartReference; C103_PartReference: =CFD10_C103_PartReference; TitleBlock_2_Page_Number: =CFD10_TitleBlock_2_Page_Number
CFD11 = PAGE11.SchDoc: anodeOut (in), sclk (in), serIn (in), load_n (in), serOut (out), testPulser (in), CFDout (out)  | D101_PartReference: =CFD11_D101_PartReference; R107_PartReference: =CFD11_R107_PartReference; R105_PartReference: =CFD11_R105_PartReference; R104_PartReference: =CFD11_R104_PartReference; DL101_PartReference: =CFD11_DL101_PartReference; C104_PartReference: =CFD11_C104_PartReference; R108_PartReference: =CFD11_R108_PartReference; C102_PartReference: =CFD11_C102_PartReference; R109_PartReference: =CFD11_R109_PartReference; R102_PartReference: =CFD11_R102_PartReference; R101_PartReference: =CFD11_R101_PartReference; R103_PartReference: =CFD11_R103_PartReference; C105_PartReference: =CFD11_C105_PartReference; U101_PartReference: =CFD11_U101_PartReference; C101_PartReference: =CFD11_C101_PartReference; C107_PartReference: =CFD11_C107_PartReference; R106_PartReference: =CFD11_R106_PartReference; C106_PartReference: =CFD11_C106_PartReference; C100_PartReference: =CFD11_C100_PartReference; C103_PartReference: =CFD11_C103_PartReference; TitleBlock_2_Page_Number: =CFD11_TitleBlock_2_Page_Number
CFD12 = PAGE12.SchDoc: anodeOut (in), sclk (in), serIn (in), load_n (in), serOut (out), testPulser (in), CFDout (out)  | R1204_PartReference: =CFD12_R1204_PartReference; D1201_PartReference: =CFD12_D1201_PartReference; R1205_PartReference: =CFD12_R1205_PartReference; C1200_PartReference: =CFD12_C1200_PartReference; R1206_PartReference: =CFD12_R1206_PartReference; R108_PartReference: =CFD12_R108_PartReference; U1201_PartReference: =CFD12_U1201_PartReference; R1202_PartReference: =CFD12_R1202_PartReference; R1207_PartReference: =CFD12_R1207_PartReference; C1204_PartReference: =CFD12_C1204_PartReference; R1203_PartReference: =CFD12_R1203_PartReference; C1201_PartReference: =CFD12_C1201_PartReference; C1206_PartReference: =CFD12_C1206_PartReference; C1207_PartReference: =CFD12_C1207_PartReference; C1205_PartReference: =CFD12_C1205_PartReference; DL1201_PartReference: =CFD12_DL1201_PartReference; R1201_PartReference: =CFD12_R1201_PartReference; R1209_PartReference: =CFD12_R1209_PartReference; C1203_PartReference: =CFD12_C1203_PartReference; C1202_PartReference: =CFD12_C1202_PartReference; TitleBlock_1_Page_Number: =CFD12_TitleBlock_1_Page_Number
CFD13 = PAGE13.SchDoc: anodeOut (in), sclk (in), serIn (in), load_n (in), serOut (out), testPulser (in), CFDout (out)  | R105_PartReference: =CFD13_R105_PartReference; R104_PartReference: =CFD13_R104_PartReference; D1301_PartReference: =CFD13_D1301_PartReference; R1307_PartReference: =CFD13_R1307_PartReference; DL101_PartReference: =CFD13_DL101_PartReference; C104_PartReference: =CFD13_C104_PartReference; R108_PartReference: =CFD13_R108_PartReference; C102_PartReference: =CFD13_C102_PartReference; R102_PartReference: =CFD13_R102_PartReference; R101_PartReference: =CFD13_R101_PartReference; R103_PartReference: =CFD13_R103_PartReference; C105_PartReference: =CFD13_C105_PartReference; U101_PartReference: =CFD13_U101_PartReference; C101_PartReference: =CFD13_C101_PartReference; C107_PartReference: =CFD13_C107_PartReference; R106_PartReference: =CFD13_R106_PartReference; C106_PartReference: =CFD13_C106_PartReference; C100_PartReference: =CFD13_C100_PartReference; R1309_PartReference: =CFD13_R1309_PartReference; C103_PartReference: =CFD13_C103_PartReference; TitleBlock_2_Page_Number: =CFD13_TitleBlock_2_Page_Number
CFD14 = PAGE12.SchDoc: anodeOut (in), sclk (in), serIn (in), load_n (in), serOut (out), testPulser (in), CFDout (out)  | R1204_PartReference: =CFD14_R1204_PartReference; D1201_PartReference: =CFD14_D1201_PartReference; R1205_PartReference: =CFD14_R1205_PartReference; C1200_PartReference: =CFD14_C1200_PartReference; R1206_PartReference: =CFD14_R1206_PartReference; R108_PartReference: =CFD14_R108_PartReference; U1201_PartReference: =CFD14_U1201_PartReference; R1202_PartReference: =CFD14_R1202_PartReference; R1207_PartReference: =CFD14_R1207_PartReference; C1204_PartReference: =CFD14_C1204_PartReference; R1203_PartReference: =CFD14_R1203_PartReference; C1201_PartReference: =CFD14_C1201_PartReference; C1206_PartReference: =CFD14_C1206_PartReference; C1207_PartReference: =CFD14_C1207_PartReference; C1205_PartReference: =CFD14_C1205_PartReference; DL1201_PartReference: =CFD14_DL1201_PartReference; R1201_PartReference: =CFD14_R1201_PartReference; R1209_PartReference: =CFD14_R1209_PartReference; C1203_PartReference: =CFD14_C1203_PartReference; C1202_PartReference: =CFD14_C1202_PartReference; TitleBlock_1_Page_Number: =CFD14_TitleBlock_1_Page_Number
CFD15 = PAGE13.SchDoc: anodeOut (in), sclk (in), serIn (in), load_n (in), serOut (out), testPulser (in), CFDout (out)  | R105_PartReference: =CFD15_R105_PartReference; R104_PartReference: =CFD15_R104_PartReference; D1301_PartReference: =CFD15_D1301_PartReference; R1307_PartReference: =CFD15_R1307_PartReference; DL101_PartReference: =CFD15_DL101_PartReference; C104_PartReference: =CFD15_C104_PartReference; R108_PartReference: =CFD15_R108_PartReference; C102_PartReference: =CFD15_C102_PartReference; R102_PartReference: =CFD15_R102_PartReference; R101_PartReference: =CFD15_R101_PartReference; R103_PartReference: =CFD15_R103_PartReference; C105_PartReference: =CFD15_C105_PartReference; U101_PartReference: =CFD15_U101_PartReference; C101_PartReference: =CFD15_C101_PartReference; C107_PartReference: =CFD15_C107_PartReference; R106_PartReference: =CFD15_R106_PartReference; C106_PartReference: =CFD15_C106_PartReference; C100_PartReference: =CFD15_C100_PartReference; R1309_PartReference: =CFD15_R1309_PartReference; C103_PartReference: =CFD15_C103_PartReference; TitleBlock_2_Page_Number: =CFD15_TitleBlock_2_Page_Number
CFD16 = PAGE12.SchDoc: anodeOut (in), sclk (in), serIn (in), load_n (in), serOut (out), testPulser (in), CFDout (out)  | R1204_PartReference: =CFD16_R1204_PartReference; D1201_PartReference: =CFD16_D1201_PartReference; R1205_PartReference: =CFD16_R1205_PartReference; C1200_PartReference: =CFD16_C1200_PartReference; R1206_PartReference: =CFD16_R1206_PartReference; R108_PartReference: =CFD16_R108_PartReference; U1201_PartReference: =CFD16_U1201_PartReference; R1202_PartReference: =CFD16_R1202_PartReference; R1207_PartReference: =CFD16_R1207_PartReference; C1204_PartReference: =CFD16_C1204_PartReference; R1203_PartReference: =CFD16_R1203_PartReference; C1201_PartReference: =CFD16_C1201_PartReference; C1206_PartReference: =CFD16_C1206_PartReference; C1207_PartReference: =CFD16_C1207_PartReference; C1205_PartReference: =CFD16_C1205_PartReference; DL1201_PartReference: =CFD16_DL1201_PartReference; R1201_PartReference: =CFD16_R1201_PartReference; R1209_PartReference: =CFD16_R1209_PartReference; C1203_PartReference: =CFD16_C1203_PartReference; C1202_PartReference: =CFD16_C1202_PartReference; TitleBlock_1_Page_Number: =CFD16_TitleBlock_1_Page_Number
CFD17 = PAGE13.SchDoc: anodeOut (in), sclk (in), serIn (in), load_n (in), serOut (out), testPulser (in), CFDout (out)  | R105_PartReference: =CFD17_R105_PartReference; R104_PartReference: =CFD17_R104_PartReference; D1301_PartReference: =CFD17_D1301_PartReference; R1307_PartReference: =CFD17_R1307_PartReference; DL101_PartReference: =CFD17_DL101_PartReference; C104_PartReference: =CFD17_C104_PartReference; R108_PartReference: =CFD17_R108_PartReference; C102_PartReference: =CFD17_C102_PartReference; R102_PartReference: =CFD17_R102_PartReference; R101_PartReference: =CFD17_R101_PartReference; R103_PartReference: =CFD17_R103_PartReference; C105_PartReference: =CFD17_C105_PartReference; U101_PartReference: =CFD17_U101_PartReference; C101_PartReference: =CFD17_C101_PartReference; C107_PartReference: =CFD17_C107_PartReference; R106_PartReference: =CFD17_R106_PartReference; C106_PartReference: =CFD17_C106_PartReference; C100_PartReference: =CFD17_C100_PartReference; R1309_PartReference: =CFD17_R1309_PartReference; C103_PartReference: =CFD17_C103_PartReference; TitleBlock_2_Page_Number: =CFD17_TitleBlock_2_Page_Number
CFD18 = PAGE12.SchDoc: anodeOut (in), sclk (in), serIn (in), load_n (in), serOut (out), testPulser (in), CFDout (out)  | R1204_PartReference: =CFD18_R1204_PartReference; D1201_PartReference: =CFD18_D1201_PartReference; R1205_PartReference: =CFD18_R1205_PartReference; C1200_PartReference: =CFD18_C1200_PartReference; R1206_PartReference: =CFD18_R1206_PartReference; R108_PartReference: =CFD18_R108_PartReference; U1201_PartReference: =CFD18_U1201_PartReference; R1202_PartReference: =CFD18_R1202_PartReference; R1207_PartReference: =CFD18_R1207_PartReference; C1204_PartReference: =CFD18_C1204_PartReference; R1203_PartReference: =CFD18_R1203_PartReference; C1201_PartReference: =CFD18_C1201_PartReference; C1206_PartReference: =CFD18_C1206_PartReference; C1207_PartReference: =CFD18_C1207_PartReference; C1205_PartReference: =CFD18_C1205_PartReference; DL1201_PartReference: =CFD18_DL1201_PartReference; R1201_PartReference: =CFD18_R1201_PartReference; R1209_PartReference: =CFD18_R1209_PartReference; C1203_PartReference: =CFD18_C1203_PartReference; C1202_PartReference: =CFD18_C1202_PartReference; TitleBlock_1_Page_Number: =CFD18_TitleBlock_1_Page_Number
CFD19 = PAGE13.SchDoc: anodeOut (in), sclk (in), serIn (in), load_n (in), serOut (out), testPulser (in), CFDout (out)  | R105_PartReference: =CFD19_R105_PartReference; R104_PartReference: =CFD19_R104_PartReference; D1301_PartReference: =CFD19_D1301_PartReference; R1307_PartReference: =CFD19_R1307_PartReference; DL101_PartReference: =CFD19_DL101_PartReference; C104_PartReference: =CFD19_C104_PartReference; R108_PartReference: =CFD19_R108_PartReference; C102_PartReference: =CFD19_C102_PartReference; R102_PartReference: =CFD19_R102_PartReference; R101_PartReference: =CFD19_R101_PartReference; R103_PartReference: =CFD19_R103_PartReference; C105_PartReference: =CFD19_C105_PartReference; U101_PartReference: =CFD19_U101_PartReference; C101_PartReference: =CFD19_C101_PartReference; C107_PartReference: =CFD19_C107_PartReference; R106_PartReference: =CFD19_R106_PartReference; C106_PartReference: =CFD19_C106_PartReference; C100_PartReference: =CFD19_C100_PartReference; R1309_PartReference: =CFD19_R1309_PartReference; C103_PartReference: =CFD19_C103_PartReference; TitleBlock_2_Page_Number: =CFD19_TitleBlock_2_Page_Number
CFD20 = PAGE12.SchDoc: anodeOut (in), sclk (in), serIn (in), load_n (in), serOut (out), testPulser (in), CFDout (out)  | R1204_PartReference: =CFD20_R1204_PartReference; D1201_PartReference: =CFD20_D1201_PartReference; R1205_PartReference: =CFD20_R1205_PartReference; C1200_PartReference: =CFD20_C1200_PartReference; R1206_PartReference: =CFD20_R1206_PartReference; R108_PartReference: =CFD20_R108_PartReference; U1201_PartReference: =CFD20_U1201_PartReference; R1202_PartReference: =CFD20_R1202_PartReference; R1207_PartReference: =CFD20_R1207_PartReference; C1204_PartReference: =CFD20_C1204_PartReference; R1203_PartReference: =CFD20_R1203_PartReference; C1201_PartReference: =CFD20_C1201_PartReference; C1206_PartReference: =CFD20_C1206_PartReference; C1207_PartReference: =CFD20_C1207_PartReference; C1205_PartReference: =CFD20_C1205_PartReference; DL1201_PartReference: =CFD20_DL1201_PartReference; R1201_PartReference: =CFD20_R1201_PartReference; R1209_PartReference: =CFD20_R1209_PartReference; C1203_PartReference: =CFD20_C1203_PartReference; C1202_PartReference: =CFD20_C1202_PartReference; TitleBlock_1_Page_Number: =CFD20_TitleBlock_1_Page_Number
CFD21 = PAGE13.SchDoc: anodeOut (in), sclk (in), serIn (in), load_n (in), serOut (out), testPulser (in), CFDout (out)  | R105_PartReference: =CFD21_R105_PartReference; R104_PartReference: =CFD21_R104_PartReference; D1301_PartReference: =CFD21_D1301_PartReference; R1307_PartReference: =CFD21_R1307_PartReference; DL101_PartReference: =CFD21_DL101_PartReference; C104_PartReference: =CFD21_C104_PartReference; R108_PartReference: =CFD21_R108_PartReference; C102_PartReference: =CFD21_C102_PartReference; R102_PartReference: =CFD21_R102_PartReference; R101_PartReference: =CFD21_R101_PartReference; R103_PartReference: =CFD21_R103_PartReference; C105_PartReference: =CFD21_C105_PartReference; U101_PartReference: =CFD21_U101_PartReference; C101_PartReference: =CFD21_C101_PartReference; C107_PartReference: =CFD21_C107_PartReference; R106_PartReference: =CFD21_R106_PartReference; C106_PartReference: =CFD21_C106_PartReference; C100_PartReference: =CFD21_C100_PartReference; R1309_PartReference: =CFD21_R1309_PartReference; C103_PartReference: =CFD21_C103_PartReference; TitleBlock_2_Page_Number: =CFD21_TitleBlock_2_Page_Number
CFD22 = PAGE12.SchDoc: anodeOut (in), sclk (in), serIn (in), load_n (in), serOut (out), testPulser (in), CFDout (out)  | R1204_PartReference: =CFD22_R1204_PartReference; D1201_PartReference: =CFD22_D1201_PartReference; R1205_PartReference: =CFD22_R1205_PartReference; C1200_PartReference: =CFD22_C1200_PartReference; R1206_PartReference: =CFD22_R1206_PartReference; R108_PartReference: =CFD22_R108_PartReference; U1201_PartReference: =CFD22_U1201_PartReference; R1202_PartReference: =CFD22_R1202_PartReference; R1207_PartReference: =CFD22_R1207_PartReference; C1204_PartReference: =CFD22_C1204_PartReference; R1203_PartReference: =CFD22_R1203_PartReference; C1201_PartReference: =CFD22_C1201_PartReference; C1206_PartReference: =CFD22_C1206_PartReference; C1207_PartReference: =CFD22_C1207_PartReference; C1205_PartReference: =CFD22_C1205_PartReference; DL1201_PartReference: =CFD22_DL1201_PartReference; R1201_PartReference: =CFD22_R1201_PartReference; R1209_PartReference: =CFD22_R1209_PartReference; C1203_PartReference: =CFD22_C1203_PartReference; C1202_PartReference: =CFD22_C1202_PartReference; TitleBlock_1_Page_Number: =CFD22_TitleBlock_1_Page_Number
CFD23 = PAGE12.SchDoc: anodeOut (in), sclk (in), serIn (in), load_n (in), serOut (out), testPulser (in), CFDout (out)  | R1204_PartReference: =CFD23_R1204_PartReference; D1201_PartReference: =CFD23_D1201_PartReference; R1205_PartReference: =CFD23_R1205_PartReference; C1200_PartReference: =CFD23_C1200_PartReference; R1206_PartReference: =CFD23_R1206_PartReference; R108_PartReference: =CFD23_R108_PartReference; U1201_PartReference: =CFD23_U1201_PartReference; R1202_PartReference: =CFD23_R1202_PartReference; R1207_PartReference: =CFD23_R1207_PartReference; C1204_PartReference: =CFD23_C1204_PartReference; R1203_PartReference: =CFD23_R1203_PartReference; C1201_PartReference: =CFD23_C1201_PartReference; C1206_PartReference: =CFD23_C1206_PartReference; C1207_PartReference: =CFD23_C1207_PartReference; C1205_PartReference: =CFD23_C1205_PartReference; DL1201_PartReference: =CFD23_DL1201_PartReference; R1201_PartReference: =CFD23_R1201_PartReference; R1209_PartReference: =CFD23_R1209_PartReference; C1203_PartReference: =CFD23_C1203_PartReference; C1202_PartReference: =CFD23_C1202_PartReference; TitleBlock_1_Page_Number: =CFD23_TitleBlock_1_Page_Number
CFD24 = PAGE12.SchDoc: anodeOut (in), sclk (in), serIn (in), load_n (in), serOut (out), testPulser (in), CFDout (out)  | R1204_PartReference: =CFD24_R1204_PartReference; D1201_PartReference: =CFD24_D1201_PartReference; R1205_PartReference: =CFD24_R1205_PartReference; C1200_PartReference: =CFD24_C1200_PartReference; R1206_PartReference: =CFD24_R1206_PartReference; R108_PartReference: =CFD24_R108_PartReference; U1201_PartReference: =CFD24_U1201_PartReference; R1202_PartReference: =CFD24_R1202_PartReference; R1207_PartReference: =CFD24_R1207_PartReference; C1204_PartReference: =CFD24_C1204_PartReference; R1203_PartReference: =CFD24_R1203_PartReference; C1201_PartReference: =CFD24_C1201_PartReference; C1206_PartReference: =CFD24_C1206_PartReference; C1207_PartReference: =CFD24_C1207_PartReference; C1205_PartReference: =CFD24_C1205_PartReference; DL1201_PartReference: =CFD24_DL1201_PartReference; R1201_PartReference: =CFD24_R1201_PartReference; R1209_PartReference: =CFD24_R1209_PartReference; C1203_PartReference: =CFD24_C1203_PartReference; C1202_PartReference: =CFD24_C1202_PartReference; TitleBlock_1_Page_Number: =CFD24_TitleBlock_1_Page_Number
CFD25 = PAGE12.SchDoc: anodeOut (in), sclk (in), serIn (in), load_n (in), serOut (out), testPulser (in), CFDout (out)  | R1204_PartReference: =CFD25_R1204_PartReference; D1201_PartReference: =CFD25_D1201_PartReference; R1205_PartReference: =CFD25_R1205_PartReference; C1200_PartReference: =CFD25_C1200_PartReference; R1206_PartReference: =CFD25_R1206_PartReference; R108_PartReference: =CFD25_R108_PartReference; U1201_PartReference: =CFD25_U1201_PartReference; R1202_PartReference: =CFD25_R1202_PartReference; R1207_PartReference: =CFD25_R1207_PartReference; C1204_PartReference: =CFD25_C1204_PartReference; R1203_PartReference: =CFD25_R1203_PartReference; C1201_PartReference: =CFD25_C1201_PartReference; C1206_PartReference: =CFD25_C1206_PartReference; C1207_PartReference: =CFD25_C1207_PartReference; C1205_PartReference: =CFD25_C1205_PartReference; DL1201_PartReference: =CFD25_DL1201_PartReference; R1201_PartReference: =CFD25_R1201_PartReference; R1209_PartReference: =CFD25_R1209_PartReference; C1203_PartReference: =CFD25_C1203_PartReference; C1202_PartReference: =CFD25_C1202_PartReference; TitleBlock_1_Page_Number: =CFD25_TitleBlock_1_Page_Number
CFD26 = PAGE12.SchDoc: anodeOut (in), sclk (in), serIn (in), load_n (in), serOut (out), testPulser (in), CFDout (out)  | R1204_PartReference: =CFD26_R1204_PartReference; D1201_PartReference: =CFD26_D1201_PartReference; R1205_PartReference: =CFD26_R1205_PartReference; C1200_PartReference: =CFD26_C1200_PartReference; R1206_PartReference: =CFD26_R1206_PartReference; R108_PartReference: =CFD26_R108_PartReference; U1201_PartReference: =CFD26_U1201_PartReference; R1202_PartReference: =CFD26_R1202_PartReference; R1207_PartReference: =CFD26_R1207_PartReference; C1204_PartReference: =CFD26_C1204_PartReference; R1203_PartReference: =CFD26_R1203_PartReference; C1201_PartReference: =CFD26_C1201_PartReference; C1206_PartReference: =CFD26_C1206_PartReference; C1207_PartReference: =CFD26_C1207_PartReference; C1205_PartReference: =CFD26_C1205_PartReference; DL1201_PartReference: =CFD26_DL1201_PartReference; R1201_PartReference: =CFD26_R1201_PartReference; R1209_PartReference: =CFD26_R1209_PartReference; C1203_PartReference: =CFD26_C1203_PartReference; C1202_PartReference: =CFD26_C1202_PartReference; TitleBlock_1_Page_Number: =CFD26_TitleBlock_1_Page_Number
CFD27 = PAGE12.SchDoc: anodeOut (in), sclk (in), serIn (in), load_n (in), serOut (out), testPulser (in), CFDout (out)  | R1204_PartReference: =CFD27_R1204_PartReference; D1201_PartReference: =CFD27_D1201_PartReference; R1205_PartReference: =CFD27_R1205_PartReference; C1200_PartReference: =CFD27_C1200_PartReference; R1206_PartReference: =CFD27_R1206_PartReference; R108_PartReference: =CFD27_R108_PartReference; U1201_PartReference: =CFD27_U1201_PartReference; R1202_PartReference: =CFD27_R1202_PartReference; R1207_PartReference: =CFD27_R1207_PartReference; C1204_PartReference: =CFD27_C1204_PartReference; R1203_PartReference: =CFD27_R1203_PartReference; C1201_PartReference: =CFD27_C1201_PartReference; C1206_PartReference: =CFD27_C1206_PartReference; C1207_PartReference: =CFD27_C1207_PartReference; C1205_PartReference: =CFD27_C1205_PartReference; DL1201_PartReference: =CFD27_DL1201_PartReference; R1201_PartReference: =CFD27_R1201_PartReference; R1209_PartReference: =CFD27_R1209_PartReference; C1203_PartReference: =CFD27_C1203_PartReference; C1202_PartReference: =CFD27_C1202_PartReference; TitleBlock_1_Page_Number: =CFD27_TitleBlock_1_Page_Number

## Ports
load_n1 (in), load_n2 (in), load_n3 (in), load_n4 (in), load_n5 (in), load_n6 (in), load_n7 (in), load_n8 (in), load_n9 (in), load_n10 (in), load_n11 (in), sclk1 (in), sclk2 (in), sclk3 (in), sclk4 (in), sclk5 (in), sclk6 (in), serin (in), serOut11 (out), start0 (out), start2 (out), start4 (out), start6 (out), start8 (out), start10 (out), start11 (out), start12 (out), start13 (out), start14 (out), start15 (out), stop0 (out), stop1 (out), stop2 (out), stop3 (out), stop4 (out), stop5 (out), stop6 (out), stop7 (out), stop8 (out), stop9 (out), stop10 (out), stop11 (out), stop12 (out), stop13 (out), stop14 (out), stop15 (out), tp_start1 (in), tp_start2 (in), tp_start3 (in), tp_start4 (in), tp_stop1 (in), tp_stop2 (in), tp_stop3 (in), tp_stop4 (in)

## Nets
anode1: A1.1(a) ; sheet CFD1/anodeOut
anode2: A2.1(a) ; sheet CFD2/anodeOut
anode3: A3.1(a) ; sheet CFD3/anodeOut
anode4: A4.1(a) ; sheet CFD4/anodeOut
anode5: A5.1(a) ; sheet CFD5/anodeOut
anode6: A6.1(a) ; sheet CFD6/anodeOut
anode7: A7.1(a) ; sheet CFD7/anodeOut
anode8: A8.1(a) ; sheet CFD8/anodeOut
anode9: A9.1(a) ; sheet CFD9/anodeOut
anode10: A10.1(a) ; sheet CFD10/anodeOut
anode11: A11.1(a) ; sheet CFD11/anodeOut
anode12: A12.1(a) ; sheet CFD12/anodeOut
anode13: A13.1(a) ; sheet CFD13/anodeOut
anode14: A14.1(a) ; sheet CFD14/anodeOut
anode15: A15.1(a) ; sheet CFD15/anodeOut
anode16: A16.1(a) ; sheet CFD16/anodeOut
anode17: A17.1(a) ; sheet CFD17/anodeOut
anode18: A18.1(a) ; sheet CFD18/anodeOut
anode19: A19.1(a) ; sheet CFD19/anodeOut
anode20: A20.1(a) ; sheet CFD20/anodeOut
anode21: A21.1(a) ; sheet CFD21/anodeOut
anode22: A22.1(a) ; sheet CFD22/anodeOut
anode23: A23.1(a) ; sheet CFD23/anodeOut
anode24: A24.1(a) ; sheet CFD24/anodeOut
anode25: A25.1(a) ; sheet CFD25/anodeOut
anode26: A26.1(a) ; sheet CFD26/anodeOut
anode27: A27.1(a) ; sheet CFD27/anodeOut
load_n1: sheet CFD13/load_n, sheet CFD1/load_n, sheet CFD12/load_n
load_n2: sheet CFD15/load_n, sheet CFD14/load_n, sheet CFD2/load_n
load_n3: sheet CFD17/load_n, sheet CFD3/load_n, sheet CFD16/load_n
load_n4: sheet CFD18/load_n, sheet CFD4/load_n, sheet CFD19/load_n
load_n5: sheet CFD5/load_n, sheet CFD20/load_n, sheet CFD21/load_n
load_n6: sheet CFD22/load_n, sheet CFD6/load_n
load_n7: sheet CFD7/load_n, sheet CFD23/load_n
load_n8: sheet CFD24/load_n, sheet CFD8/load_n
load_n9: sheet CFD9/load_n, sheet CFD25/load_n
load_n10: sheet CFD26/load_n, sheet CFD10/load_n
load_n11: sheet CFD11/load_n, sheet CFD27/load_n
sclk1: sheet CFD15/sclk, sheet CFD13/sclk, sheet CFD1/sclk, sheet CFD14/sclk, sheet CFD12/sclk, sheet CFD2/sclk
sclk2: sheet CFD17/sclk, sheet CFD3/sclk, sheet CFD18/sclk, sheet CFD16/sclk, sheet CFD4/sclk, sheet CFD19/sclk
sclk3: sheet CFD5/sclk, sheet CFD20/sclk, sheet CFD21/sclk
sclk4: sheet CFD7/sclk, sheet CFD22/sclk, sheet CFD23/sclk, sheet CFD6/sclk
sclk5: sheet CFD9/sclk, sheet CFD24/sclk, sheet CFD25/sclk, sheet CFD8/sclk
sclk6: sheet CFD11/sclk, sheet CFD26/sclk, sheet CFD10/sclk, sheet CFD27/sclk
serin: sheet CFD13/serIn
serOut1: sheet CFD15/serIn, sheet CFD1/serOut
serOut2: sheet CFD17/serIn, sheet CFD2/serOut
serOut3: sheet CFD3/serOut, sheet CFD19/serIn
serOut4: sheet CFD21/serIn, sheet CFD4/serOut
serOut5: sheet CFD22/serIn, sheet CFD5/serOut
serOut6: sheet CFD23/serIn, sheet CFD6/serOut
serOut7: sheet CFD24/serIn, sheet CFD7/serOut
serOut8: sheet CFD25/serIn, sheet CFD8/serOut
serOut9: sheet CFD9/serOut, sheet CFD26/serIn
serOut10: sheet CFD10/serOut, sheet CFD27/serIn
serOut11: port serOut11, sheet CFD11/serOut
serOut12: sheet CFD1/serIn, sheet CFD12/serOut
serOut13: sheet CFD13/serOut, sheet CFD12/serIn
serOut14: sheet CFD14/serOut, sheet CFD2/serIn
serOut15: sheet CFD15/serOut, sheet CFD14/serIn
serOut16: sheet CFD3/serIn, sheet CFD16/serOut
serOut17: sheet CFD17/serOut, sheet CFD16/serIn
serOut18: sheet CFD18/serOut, sheet CFD4/serIn
serOut19: sheet CFD18/serIn, sheet CFD19/serOut
serOut20: sheet CFD5/serIn, sheet CFD20/serOut
serOut21: sheet CFD20/serIn, sheet CFD21/serOut
serOut22: sheet CFD22/serOut, sheet CFD6/serIn
serOut23: sheet CFD7/serIn, sheet CFD23/serOut
serOut24: sheet CFD24/serOut, sheet CFD8/serIn
serOut25: sheet CFD9/serIn, sheet CFD25/serOut
serOut26: sheet CFD26/serOut, sheet CFD10/serIn
serOut27: sheet CFD11/serIn, sheet CFD27/serOut
start0: port start0, sheet CFD1/CFDout
start2: port start2, sheet CFD2/CFDout
start4: port start4, sheet CFD3/CFDout
start6: port start6, sheet CFD4/CFDout
start8: port start8, sheet CFD5/CFDout
start10: port start10, sheet CFD6/CFDout
start11: port start11, sheet CFD7/CFDout
start12: port start12, sheet CFD8/CFDout
start13: port start13, sheet CFD9/CFDout
start14: port start14, sheet CFD10/CFDout
start15: port start15, sheet CFD11/CFDout
stop0: port stop0, sheet CFD12/CFDout
stop1: port stop1, sheet CFD13/CFDout
stop2: port stop2, sheet CFD14/CFDout
stop3: port stop3, sheet CFD15/CFDout
stop4: port stop4, sheet CFD16/CFDout
stop5: port stop5, sheet CFD17/CFDout
stop6: port stop6, sheet CFD18/CFDout
stop7: port stop7, sheet CFD19/CFDout
stop8: port stop8, sheet CFD20/CFDout
stop9: port stop9, sheet CFD21/CFDout
stop10: port stop10, sheet CFD22/CFDout
stop11: port stop11, sheet CFD23/CFDout
stop12: port stop12, sheet CFD24/CFDout
stop13: port stop13, sheet CFD25/CFDout
stop14: port stop14, sheet CFD26/CFDout
stop15: port stop15, sheet CFD27/CFDout
tp_start1: sheet CFD11/testPulser, sheet CFD1/testPulser, sheet CFD4/testPulser
tp_start2: sheet CFD2/testPulser, sheet CFD6/testPulser
tp_start3: sheet CFD3/testPulser, sheet CFD9/testPulser, sheet CFD7/testPulser
tp_start4: sheet CFD5/testPulser, sheet CFD10/testPulser, sheet CFD8/testPulser
tp_stop1: sheet CFD24/testPulser, sheet CFD20/testPulser, sheet CFD16/testPulser, sheet CFD12/testPulser
tp_stop2: sheet CFD17/testPulser, sheet CFD13/testPulser, sheet CFD26/testPulser, sheet CFD21/testPulser
tp_stop3: sheet CFD22/testPulser, sheet CFD18/testPulser, sheet CFD14/testPulser, sheet CFD25/testPulser
tp_stop4: sheet CFD15/testPulser, sheet CFD27/testPulser, sheet CFD23/testPulser, sheet CFD19/testPulser

## Notes on the sheet
- (in symbol TitleBlock0) Title; Size; Document Number; Rev; Date:; Sheet; of

## Library data of the parts
A1-A27 = anode_2: PCB Footprint: anode
* = TitleBlock0: Page Number: 1; RevCode: A; Page Create Date: March  8, 1995; Page Modify Date: *